# EAGLE design Pedal Box Board rev5 (EAGLE 8.4.1)
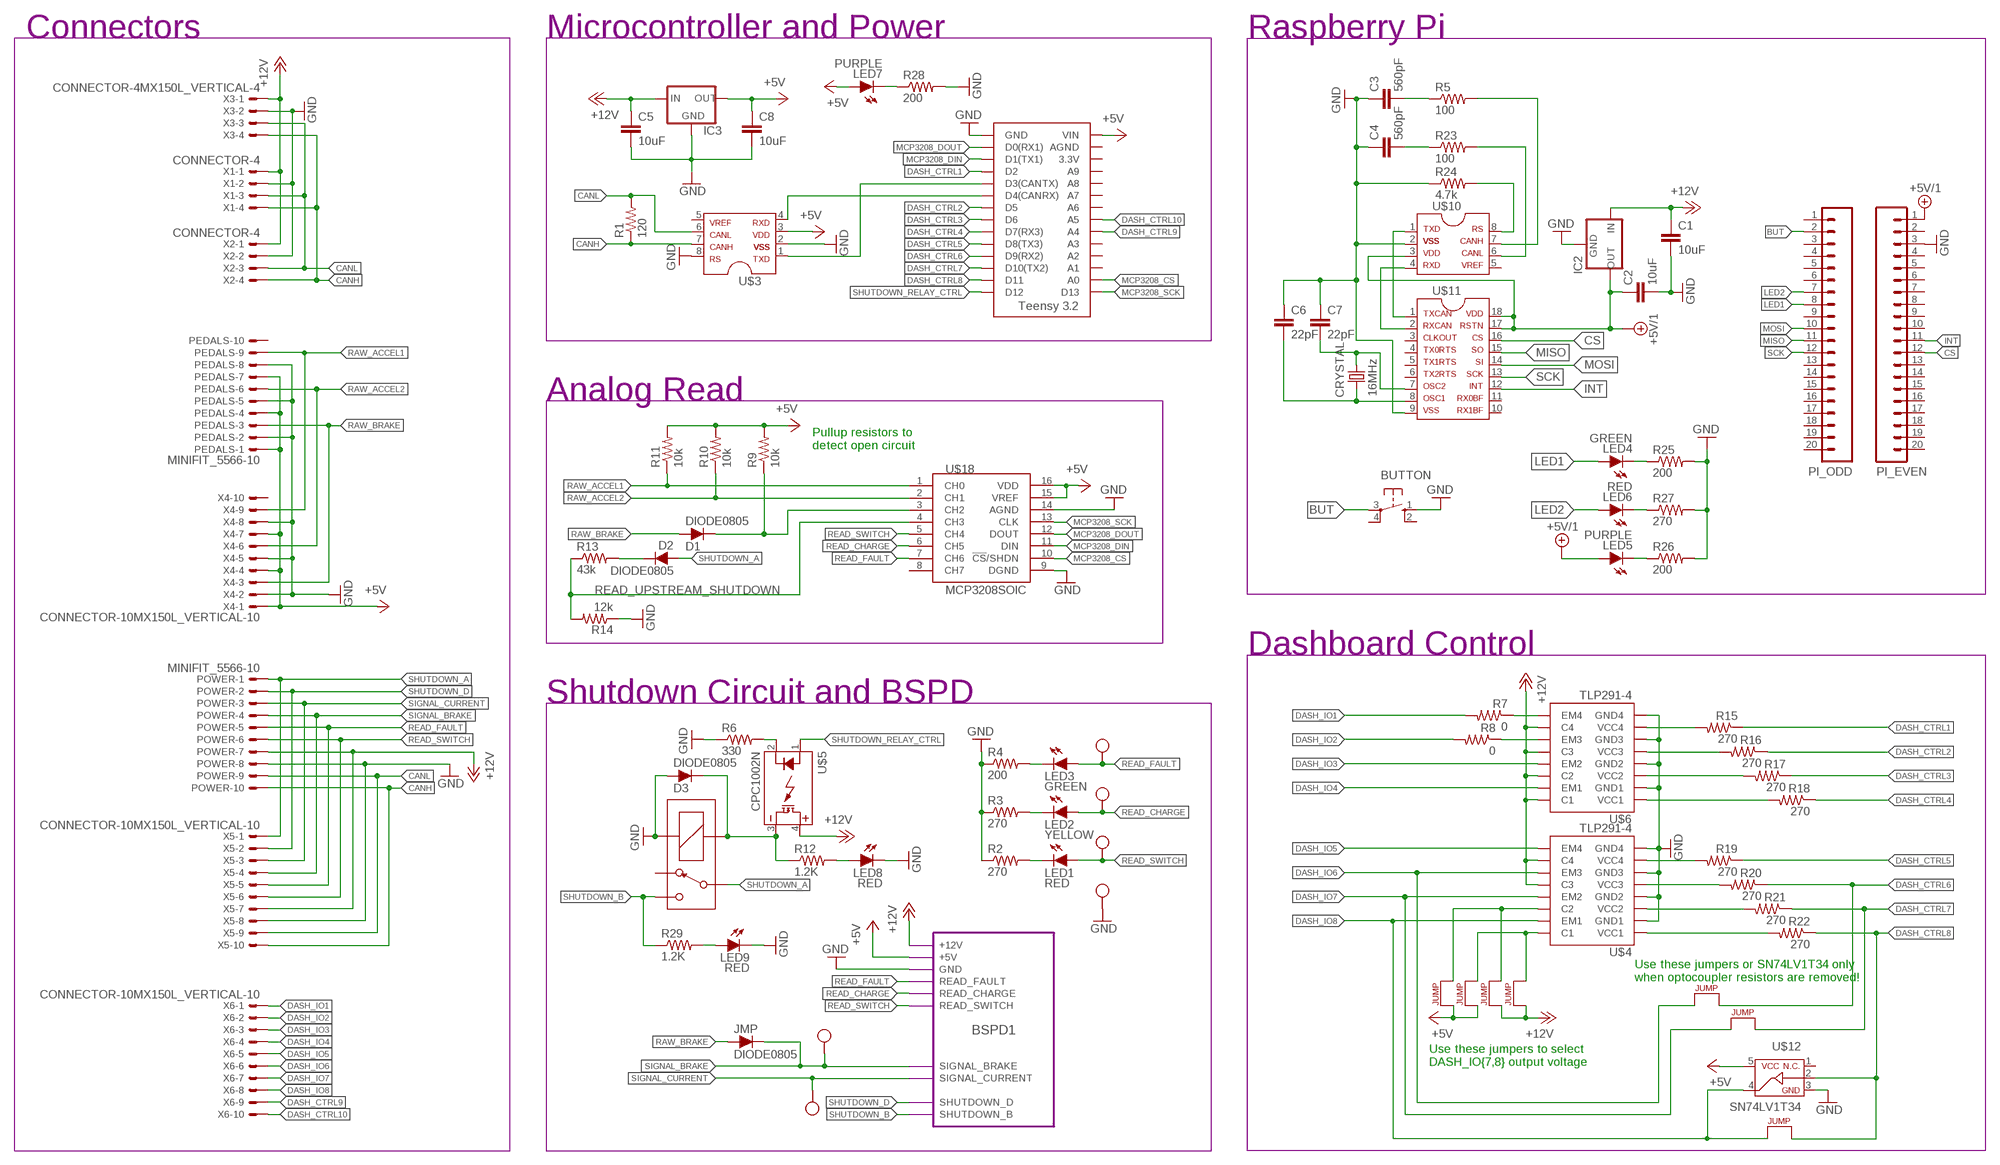
[diagram p0: schematic, sheet 1]

## Parts
BUTTON  BTN_10-XX  [B3F-10XX]
C1  10uF  CAP0805  [0805]
C2  10uF  CAP0805  [0805]
C3  560pF  CAP0805  [0805]
C4  560pF  CAP0805  [0805]
C5  10uF  CAP0805  [0805]
C6  22pF  CAP0805  [0805]
C7  22pF  CAP0805  [0805]
C8  10uF  CAP0805  [0805]
CRYSTAL  16MHz  CRYSTALSMD  [HC49UP]
D1  DIODE0805  [0805_D]
D2  DIODE0805  [0805_D]
D3  DIODE0805  [0805_D]
IC2  OKI-78SR-5/1.5-W36-C_VERT  [TO-220]
IC3  OKI-78SR-5/1.5-W36-C_VERT  [TO-220]
JMP  DIODE0805  [0805_D]
LED1  RED  LED-0805  [LED-805]
LED2  YELLOW  LED-0805  [LED-805]
LED3  GREEN  LED-0805  [LED-805]
LED4  GREEN  LED-0805  [LED-805]
LED5  PURPLE  LED-0805  [LED-805]
LED6  RED  LED-0805  [LED-805]
LED7  PURPLE  LED-0805  [LED-805]
LED8  RED  LED-0805  [LED-805]
LED9  RED  LED-0805  [LED-805]
PEDALS  MINIFIT_5566-10  [MINIFIT_5566-10]
PI_EVEN  M20  [1X20]
PI_ODD  M20  [1X20]
POWER  MINIFIT_5566-10  [MINIFIT_5566-10]
R1  120  RESISTOR0805-RES  [0805]
R2  270  RESISTOR0805-RES  [0805]
R3  270  RESISTOR0805-RES  [0805]
R4  200  RESISTOR0805-RES  [0805]
R5  100  RESISTOR0805-RES  [0805]
R6  330  RESISTOR0805-RES  [0805]
R7  0  RESISTOR0805-RES  [0805]
R8  0  RESISTOR0805-RES  [0805]
R9  10k  RESISTOR0805-RES  [0805]
R10  10k  RESISTOR0805-RES  [0805]
R11  10k  RESISTOR0805-RES  [0805]
R12  1.2K  RESISTOR0805-RES  [0805]
R13  43k  RESISTOR0805-RES  [0805]
R14  12k  RESISTOR0805-RES  [0805]
R15  270  RESISTOR0805-RES  [0805]
R16  270  RESISTOR0805-RES  [0805]
R17  270  RESISTOR0805-RES  [0805]
R18  270  RESISTOR0805-RES  [0805]
R19  270  RESISTOR0805-RES  [0805]
R20  270  RESISTOR0805-RES  [0805]
R21  270  RESISTOR0805-RES  [0805]
R22  270  RESISTOR0805-RES  [0805]
R23  100  RESISTOR0805-RES  [0805]
R24  4.7k  RESISTOR0805-RES  [0805]
R25  200  RESISTOR0805-RES  [0805]
R26  200  RESISTOR0805-RES  [0805]
R27  270  RESISTOR0805-RES  [0805]
R28  200  RESISTOR0805-RES  [0805]
R29  1.2K  RESISTOR0805-RES  [0805]
SOFTWARE_SHUTOFF  G5LE  [ZF112]
U$1  TEENSY_3.2_SIMPLE  [TEENSY_3.2_SIMPLE]
U$2  TEST_POINT  [TEST_POINT]
U$3  MCP2551  [SOIC-08]
U$4  TLP291-4  [SOIC-16]
U$5  CPC1002N  [SOP04]
U$6  TLP291-4  [SOIC-16]
U$7  JUMPER  [0805]
U$8  JUMPER  [0805]
U$9  JUMPER  [0805]
U$10  MCP2551  [SOIC-08]
U$11  MCP2515SMD  [SOIC-18W]
U$12  SN74LV1T34  [SOT-23-5]
U$13  TEST_POINT  [TEST_POINT]
U$14  TEST_POINT  [TEST_POINT]
U$15  TEST_POINT  [TEST_POINT]
U$16  TEST_POINT  [TEST_POINT]
U$17  TEST_POINT  [TEST_POINT]
U$18  MCP3208SOIC  [SOIC-16]
U$19  JUMPER  [0805]
U$20  JUMPER  [0805]
U$21  JUMPER  [0805]
U$22  JUMPER  [0805]
X1  CONNECTOR-4  [MINIFIT_5566-4]
X2  CONNECTOR-4  [MINIFIT_5566-4]
X3  CONNECTOR-4MX150L_VERTICAL-4  [MX150L_VERTICAL-4]
X4  CONNECTOR-10MX150L_VERTICAL-10  [MX150L_VERTICAL-10]
X5  CONNECTOR-10MX150L_VERTICAL-10  [MX150L_VERTICAL-10]
X6  CONNECTOR-10MX150L_VERTICAL-10  [MX150L_VERTICAL-10]

## Module instances
BSPD1 = BSPD

## Nets
+5V: C8.1 IC3.3(OUT) LED7.A PEDALS.1 PEDALS.4 PEDALS.7 R9.2 R10.2 R11.2 U$1.VIN U$3.3 U$12.5 U$18.15(VREF) U$18.16(VDD) U$20.1 U$22.1 X4.1 X4.4 X4.7 ; port BSPD1.+5V
+5V/1: C2.1 IC2.3(OUT) LED5.A PI_EVEN.1 U$10.3 U$11.17 U$11.18
+12V: C1.1 C5.1 IC2.1(IN) IC3.1(IN) POWER.7 U$4.10(C4) U$4.12(C3) U$5.4(DC+) U$6.10(C4) U$6.12(C3) U$6.14(C2) U$6.16(C1) U$9.1 U$21.1 X1.1 X2.1 X3.1 X5.7 ; port BSPD1.+12V
BUT: BUTTON.3(P) PI_ODD.2
CAN-H: R5.2 U$10.7
CAN-L: R23.2 U$10.6
CANH: POWER.10 R1.1 U$3.7 X1.4 X2.4 X3.4 X5.10
CANL: POWER.9 R1.2 U$3.6 X1.3 X2.3 X3.3 X5.9
CS: PI_EVEN.12 U$11.16
DASH_CTRL1: R15.1 U$1.D2
DASH_CTRL2: R16.1 U$1.D5
DASH_CTRL3: R17.1 U$1.D6
DASH_CTRL4: R18.1 U$1.D7(RX3)
DASH_CTRL5: R19.1 U$1.D8(TX3)
DASH_CTRL6: R20.1 U$1.D9(RX2) U$7.2
DASH_CTRL7: R21.1 U$1.D10(TX2) U$8.2
DASH_CTRL8: R22.1 U$1.D11 U$12.2 U$19.2
DASH_CTRL9: U$1.A4 X6.9
DASH_CTRL10: U$1.A5 X6.10
DASH_IO1: R7.2 X6.1
DASH_IO2: R8.2 X6.2
DASH_IO3: U$6.13(EM2) X6.3
DASH_IO4: U$6.15(EM1) X6.4
DASH_IO5: U$4.9(EM4) X6.5
DASH_IO6: U$4.11(EM3) U$7.1 X6.6
DASH_IO7: U$4.13(EM2) U$8.1 X6.7
DASH_IO8: U$4.15(EM1) U$12.4 U$19.1 X6.8
GND: BUTTON.1(S) C1.2 C2.2 C3.1 C4.1 C5.2 C6.1 C7.1 C8.2 D3.A IC2.2(GND) IC3.2(GND) LED8.C LED9.C PEDALS.2 PEDALS.5 PEDALS.8 PI_EVEN.3 POWER.8 R2.1 R3.1 R4.1 R6.1 R14.1 R24.1 R25.2 R26.2 R27.2 R28.2 SOFTWARE_SHUTOFF.1(COIL+) U$1.GND U$2.P$1 U$3.2 U$3.8 U$4.2(GND1) U$4.4(GND2) U$4.6(GND3) U$4.8(GND4) U$6.2(GND1) U$6.4(GND2) U$6.6(GND3) U$6.8(GND4) U$10.2 U$11.9 U$12.3 U$18.9(DGND) U$18.14(AGND) X1.2 X2.2 X3.2 X4.2 X4.5 X4.8 X5.8 ; port BSPD1.GND
INT: PI_EVEN.11 U$11.12
LED1: LED4.A PI_ODD.8
LED2: LED6.A PI_ODD.7
MCP3208_CS: U$1.A0 U$18.10(!CS!/SHDN)
MCP3208_DIN: U$1.D1(TX1) U$18.11(DIN)
MCP3208_DOUT: U$1.D0(RX1) U$18.12(DOUT)
MCP3208_SCK: U$1.D13 U$18.13(CLK)
MISO: PI_ODD.11 U$11.15
MOSI: PI_ODD.10 U$11.14
N$1: R7.1 U$6.9(EM4)
N$2: U$1.D4(CANRX) U$3.4
N$3: R8.1 U$6.11(EM3)
N$4: U$4.16(C1) U$9.2 U$20.2
N$5: U$1.D3(CANTX) U$3.1
N$6: U$4.14(C2) U$21.2 U$22.2
N$7: D1.C R9.1 U$18.3(CH2)
N$8: LED8.A R12.2
N$9: LED9.A R29.2
N$12: D3.C R12.1 SOFTWARE_SHUTOFF.2(COIL-) U$5.3(DC-)
N$13: D2.C R13.2
N$14: LED1.C R2.2
N$15: LED2.C R3.2
N$16: LED3.C R4.2
N$19: R15.2 U$6.7(VCC4)
N$22: R6.2 U$5.2(CONTROL-)
N$24: R16.2 U$6.5(VCC3)
N$27: R21.2 U$4.3(VCC2)
N$28: R17.2 U$6.3(VCC2)
N$29: R18.2 U$6.1(VCC1)
N$31: R19.2 U$4.7(VCC4)
N$32: R20.2 U$4.5(VCC3)
N$35: R22.2 U$4.1(VCC1)
N$37: U$10.1 U$11.1
N$39: U$10.4 U$11.2
N$40: C6.2 CRYSTAL.2 U$11.8
N$41: R24.2 U$10.8
N$42: C7.2 CRYSTAL.1 U$11.7
N$43: C3.2 R5.1
N$50: C4.2 R23.1
N$52: LED4.C R25.1
N$53: LED5.C R26.1
N$54: LED6.C R27.1
N$61: LED7.C R28.1
RAW_ACCEL1: PEDALS.9 R11.1 U$18.1(CH0) X4.9
RAW_ACCEL2: PEDALS.6 R10.1 U$18.2(CH1) X4.6
RAW_BRAKE: D1.A JMP.A PEDALS.3 X4.3
READ_CHARGE: LED2.A U$16.P$1 U$18.6(CH5) ; port BSPD1.READ_CHARGE
READ_FAULT: LED3.A POWER.5 U$15.P$1 U$18.7(CH6) X5.5 ; port BSPD1.READ_FAULT
READ_SWITCH: LED1.A POWER.6 U$17.P$1 U$18.5(CH4) X5.6 ; port BSPD1.READ_SWITCH
READ_UPSTREAM_SHUTDOWN: R13.1 R14.2 U$18.4(CH3)
SCK: PI_ODD.12 U$11.13
SHUTDOWN_A: D2.A POWER.1 SOFTWARE_SHUTOFF.P X5.1
SHUTDOWN_B: R29.1 SOFTWARE_SHUTOFF.S ; port BSPD1.SHUTDOWN_B
SHUTDOWN_D: POWER.2 X5.2 ; port BSPD1.SHUTDOWN_D
SHUTDOWN_RELAY_CTRL: U$1.D12 U$5.1(CONTROL+)
SIGNAL_BRAKE: JMP.C POWER.4 U$13.P$1 X5.4 ; port BSPD1.SIGNAL_BRAKE
SIGNAL_CURRENT: POWER.3 U$14.P$1 X5.3 ; port BSPD1.SIGNAL_CURRENT
Unconnected: BUTTON.2(S1) BUTTON.4(P1) PEDALS.10 PI_EVEN.2 PI_EVEN.4 PI_EVEN.5 PI_EVEN.6 PI_EVEN.7 PI_EVEN.8 PI_EVEN.9 PI_EVEN.10 PI_EVEN.13 PI_EVEN.14 PI_EVEN.15 PI_EVEN.16 PI_EVEN.17 PI_EVEN.18 PI_EVEN.19 PI_EVEN.20 PI_ODD.1 PI_ODD.3 PI_ODD.4 PI_ODD.5 PI_ODD.6 PI_ODD.9 PI_ODD.13 PI_ODD.14 PI_ODD.15 PI_ODD.16 PI_ODD.17 PI_ODD.18 PI_ODD.19 PI_ODD.20 SOFTWARE_SHUTOFF.O U$1.3.3V U$1.A1 U$1.A2 U$1.A3 U$1.A6 U$1.A7 U$1.A8 U$1.A9 U$1.AGND U$3.5 U$10.5 U$11.3 U$11.4 U$11.5 U$11.6 U$11.10 U$11.11 U$12.1 U$18.8(CH7) X4.10

## Notes on the sheet
- Connectors | Microcontroller and Power | Raspberry Pi
- Analog Read
- Pullup resistors to
  detect open circuit
- Dashboard Control
- Shutdown Circuit and BSPD
- Use these jumpers or SN74LV1T34 only
  when optocoupler resistors are removed!
- Use these jumpers to select
  DASH_IO{7,8} output voltage

## Library data of the parts
BUTTON = HyTechDevices:BTN_10-XX: Small momentary tactile push button; MPN: B3F-1000; OC_FARNELL: 176432; OC_NEWARK: 36M3542
C1-C8 = HyTechDevices:CAP: Capacitor Standard 0603 ceramic capacitor, and 0.1" leaded capacitor.
CRYSTAL = SparkFun-FreqCtrl:CRYSTAL: Various standard crystals. Proven footprints.
D1-D3 JMP = HyTechDevices:DIODE: DIODE general purpose rectifier
IC2 IC3 = HyTechDevices:OKI-78SR-5/1.5-W36-C: Voltage Regulator Switching 5v regulator Datasheet <http://power.murata.com/data/power/oki-78sr.pdf> Standard 7805 5V regulator. IGO (Input Ground Output). Spark Fun Electronics SKU : COM-00107 Datasheet <http://www.mouser.com/ds/2/308/MC7800-D-94905.pdf>
LED1-LED9 = HyTechDevices:LED: Light Emitting Diode (LED) Source: Dangerous Prototypes Eagle Library <https://github.com/DangerousPrototypes/Eagle_Part_Library>
PEDALS POWER = HyTechDevices:MINIFIT_5566-10: Mini-Fit Junior connector 10 pole Source: http://www.molex.com; OC_FARNELL: unknown; OC_NEWARK: unknown
PI_EVEN PI_ODD = HyTechDevices:M20: 1x20 .1" header This is just like the LOCK variant in that the holes are staggared by 5 mil, but except for the last two holes. They are not altered from the "standard" footprint layout. This is used for a special purpose on the layout of our Graphic LCD Backpack. Make sure you want to use this device before selecting it for you project! Source: Sparkfun <https://github.com/sparkfun/SparkFun-Eagle-Libraries>
R1-R29 = HyTechDevices:RESISTOR: Resistor Basic schematic elements and footprints for 0603, 1206, and PTH resistors.
SOFTWARE_SHUTOFF = HyTechDevices:G5LE: Omron G5LE SPST Relay 5 VDC, 12VDC, 24VDC models Coil voltage: 75% - 170% of nominal voltage Datasheet <https://www.omron.com/ecb/products/pdf/en-g5le.pdf>
U$1 = HyTechDevices:TEENSY_3.2_SIMPLE: Simple version of the Teensy 3.2 board that only uses the 2 main rows of pins, not the inner pins or the pins opposite the usb port.
U$2 U$13-U$17 = HyTechDevices:TEST_POINT: Keystone Electronics Test Point 5005
U$3 U$10 = HyTechDevices:MCP2551: MCP2551 High-Speed CAN Transceiver Product Webpage <https://www.microchip.com/wwwproducts/en/MCP2551> Datasheet <http://ww1.microchip.com/downloads/en/DeviceDoc/21667f.pdf> This device is outdated It is replaced by MCP2561. Comparison Page <https://www.microchip.com/wwwproducts/ProductCompare/MCP2551/MCP2561> Product Webpage <https://www.microchip.com/wwwproducts/en/MCP2561> Datasheet <http://ww1.microchip.com/downloads/en/DeviceDoc/20005167C.pdf>
U$4 U$6 = HyTechDevices:TLP291-4: Toshiba Quad Channel Optocoupler TLP291-4
U$5 = HyTechDevices:CPC1002N: IXYS Solid State Relay .7A
U$7-U$9 U$19-U$22 = HyTechDevices:JUMPER: Jumper for changing operation of a device
U$11 = HyTechDevices:MCP2515: MCP2515 CAN Controller with SPI Interface Datasheet <http://ww1.microchip.com/downloads/en/DeviceDoc/21801G.pdf>
U$12 = HyTechDevices:SN74LV1T34: TI SN74LV1T34 Single Power Supply Single Buffer GATE CMOS Logic Level Shifter Datasheet <http://www.ti.com/lit/ds/symlink/sn74lv1t34.pdf>
U$18 = HyTechDevices:MCP3208: Analog to Digital Converter
X1 X2 = HyTechDevices:CONNECTOR-4: Mini-Fit Junior connector 4 pole Source: http://www.molex.com; OC_FARNELL: unknown; OC_NEWARK: unknown
X3 = HyTechDevices:CONNECTOR-4: Mini-Fit Junior connector 4 pole Source: http://www.molex.com
X4-X6 = HyTechDevices:CONNECTOR-10: Mini-Fit Junior connector 10 pole Source: http://www.molex.com

## Module BSPD
Ports: GND(out) +5V(in) READ_CHARGE(out) SHUTDOWN_B(in) READ_SWITCH(out) READ_FAULT(out) SHUTDOWN_D(out) SIGNAL_BRAKE(in) SIGNAL_CURRENT(in) +12V(in)
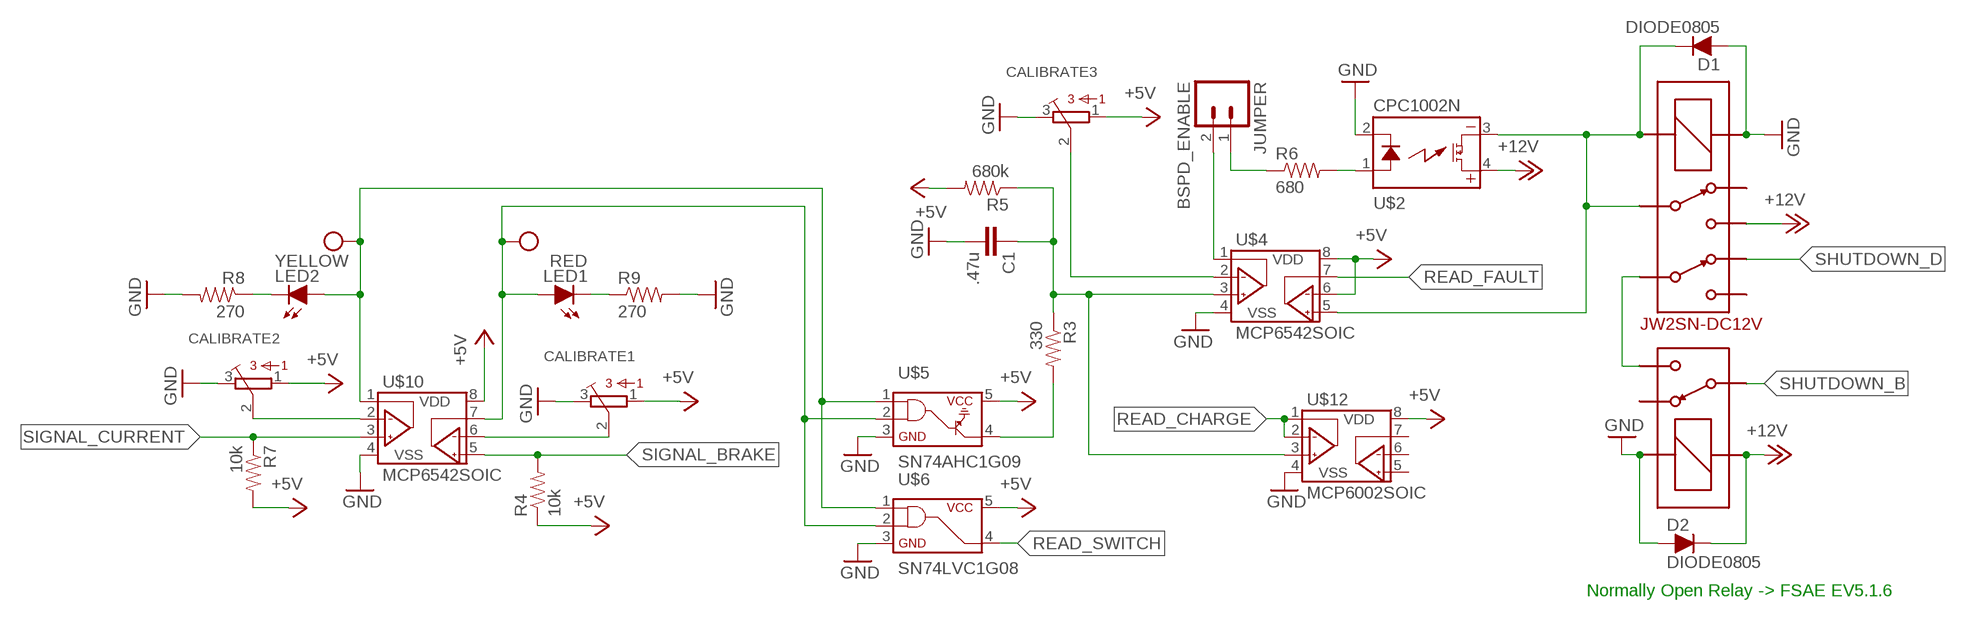
[diagram p1: schematic, module BSPD, sheet 1]

### Parts
BSPD_ENABLE  JUMPER  M02  [1X02]
C1  .47u  CAPEZ  [CAP-PTH-SMALLEZ]
CALIBRATE1  TRIMPOT_3296C  [TRIMPOT_3296]
CALIBRATE2  TRIMPOT_3296C  [TRIMPOT_3296]
CALIBRATE3  TRIMPOT_3296C  [TRIMPOT_3296]
D1  DIODE0805  [0805_D]
D2  DIODE0805  [0805_D]
LED1  RED  LED-0805  [LED-805]
LED2  YELLOW  LED-0805  [LED-805]
R3  330  RESISTOR0805-RES  [0805]
R4  10k  RESISTOR0805-RES  [0805]
R5  680k  RESISTOREZ  [AXIAL-0.3EZ]
R6  680  RESISTOR0805-RES  [0805]
R7  10k  RESISTOR0805-RES  [0805]
R8  270  RESISTOR0805-RES  [0805]
R9  270  RESISTOR0805-RES  [0805]
U$1  G5LE  [ZF112]
U$2  CPC1002N  [SOP04]
U$3  JW2SN-DC12V  [JW2SN]
U$4  MCP6542SOIC  [SOIC-08]
U$5  SN74AHC1G09  [SOT-23-5]
U$6  SN74LVC1G08  [SOT-23-5]
U$10  MCP6542SOIC  [SOIC-08]
U$11  TEST_POINT  [TEST_POINT]
U$12  MCP6002SOIC  [SOIC-08]
U$13  TEST_POINT  [TEST_POINT]

### Nets
+5V: CALIBRATE1.1 CALIBRATE2.1 CALIBRATE3.1 R4.1 R5.P$2 R7.2 U$4.6(VINB-) U$4.8(VDD) U$5.5 U$6.5 U$10.8(VDD) U$12.8(VDD)
+12V: D2.C U$1.2(COIL-) U$2.4(DC+) U$3.4
GND: C1.2 CALIBRATE1.3 CALIBRATE2.3 CALIBRATE3.3 D1.A D2.A R8.2 R9.2 U$1.1(COIL+) U$2.2(CONTROL-) U$3.COIL+ U$4.4(VSS) U$5.3 U$6.3 U$10.4(VSS) U$12.4(VSS)
N$1: D1.C U$2.3(DC-) U$3.3 U$3.COIL- U$4.5(VINB+)
N$2: R3.2 U$5.4
N$3: R6.2 U$2.1(CONTROL+)
N$4: BSPD_ENABLE.1 R6.1
N$5: CALIBRATE2.2 U$10.2(VINA-)
N$6: CALIBRATE1.2 U$10.6(VINB-)
N$7: CALIBRATE3.2 U$4.2(VINA-)
N$8: BSPD_ENABLE.2 U$4.1(VOUTA)
N$13: C1.1 R3.1 R5.P$1 U$4.3(VINA+) U$12.3(VINA+)
N$14: LED2.C R8.1
N$15: LED1.C R9.1
N$16: LED1.A U$5.2 U$6.2 U$10.7(VOUTB) U$11.P$1
N$17: LED2.A U$5.1 U$6.1 U$10.1(VOUTA) U$13.P$1
READ_CHARGE: U$12.1(VOUTA) U$12.2(VINA-)
READ_FAULT: U$4.7(VOUTB)
READ_SWITCH: U$6.4
SHUTDOWN_B: U$1.P
SHUTDOWN_C: U$1.S U$3.6
SHUTDOWN_D: U$3.7
SIGNAL_BRAKE: R4.2 U$10.5(VINB+)
SIGNAL_CURRENT: R7.1 U$10.3(VINA+)
Unconnected: U$1.O U$3.2 U$3.5 U$12.5(VINB+) U$12.6(VINB-) U$12.7(VOUTB)

### Notes on the sheet
- Normally Open Relay -> FSAE EV5.1.6

### Library data of the parts
BSPD_ENABLE = HyTechDevices:M02: Standard 2-pin 0.1" header. NOTES ON THE VARIANTS LOCK and LOCK_LONGPADS... This footprint was designed to help hold the alignment of a through-hole component (i.e. 6-pin header) while soldering it into place. You may notice that each hole has been shifted either up or down by 0.005 of an inch from it's more standard position (which is a perfectly straight line). This slight alteration caused the pins (the squares in the middle) to touch the edges of the holes. Because they are alternating, it causes a "brace" to hold the component in place. 0.005 has proven to be the perfect amount of "off-center" position when using our standard breakaway headers. Although looks a little odd when you look at the bare footprint, once you have a header in there, the alteration is very hard to notice. Also,if you push a header all the way into place, it is covered up entirely on the bottom side. This idea of altering the position of holes to aid alignment will be further integrated into the Sparkfun Library for other footprints. It can help hold any component with 3 or more connection pins. Note: The Sparkfun version includes many other packages including surface mount that may be of future interest. Source: Sparkfun <https://github.com/sparkfun/SparkFun-Eagle-Libraries>
C1 = HyTechDevices:CAP: Capacitor Standard 0603 ceramic capacitor, and 0.1" leaded capacitor.
CALIBRATE1-CALIBRATE3 = HyTechDevices:TRIMPOT_3296: 3296 Series 3/8" Square Trimmer Source <https://github.com/chiengineer/Eagle-Libraries/blob/master/Potentiometers/bourns.lbr>
D1 D2 = HyTechDevices:DIODE: DIODE general purpose rectifier
LED1 LED2 = HyTechDevices:LED: Light Emitting Diode (LED) Source: Dangerous Prototypes Eagle Library <https://github.com/DangerousPrototypes/Eagle_Part_Library>
R3-R9 = HyTechDevices:RESISTOR: Resistor Basic schematic elements and footprints for 0603, 1206, and PTH resistors.
U$1 = HyTechDevices:G5LE: Omron G5LE SPST Relay 5 VDC, 12VDC, 24VDC models Coil voltage: 75% - 170% of nominal voltage Datasheet <https://www.omron.com/ecb/products/pdf/en-g5le.pdf>
U$2 = HyTechDevices:CPC1002N: IXYS Solid State Relay .7A
U$3 = HyTechDevices:JW2SN-DC12V: Panasonic Double Pull Double Throw Relay 12VDC Datasheet <http://www.mouser.com/ds/2/316/jw-catalog-461998.pdf> Product Page <http://www.mouser.com/ProductDetail/Panasonic-Industrial-Devices/JW2SN-DC12V>
U$4 U$10 = HyTechDevices:MCP6542: Microchip MCP6542 Dual Channel Push-Pull Comparator
U$5 = HyTechDevices:SN74AHC1G09: TI SN74AHC1G09 Single 2–Input Positive-AND Gate With Open-Drain Output Datasheet <http://www.ti.com/lit/ds/symlink/sn74ahc1g09.pdf>
U$6 = HyTechDevices:SN74LVC1G08: TI SN74LVC1G08 SINGLE 2-INPUT POSITIVE-AND GATE Datasheet <http://www.ti.com/lit/ds/sces556f/sces556f.pdf>
U$11 U$13 = HyTechDevices:TEST_POINT: Keystone Electronics Test Point 5005
U$12 = HyTechDevices:MCP6002: Microchip MCP6002 Dual Channel Op Amp

## Board
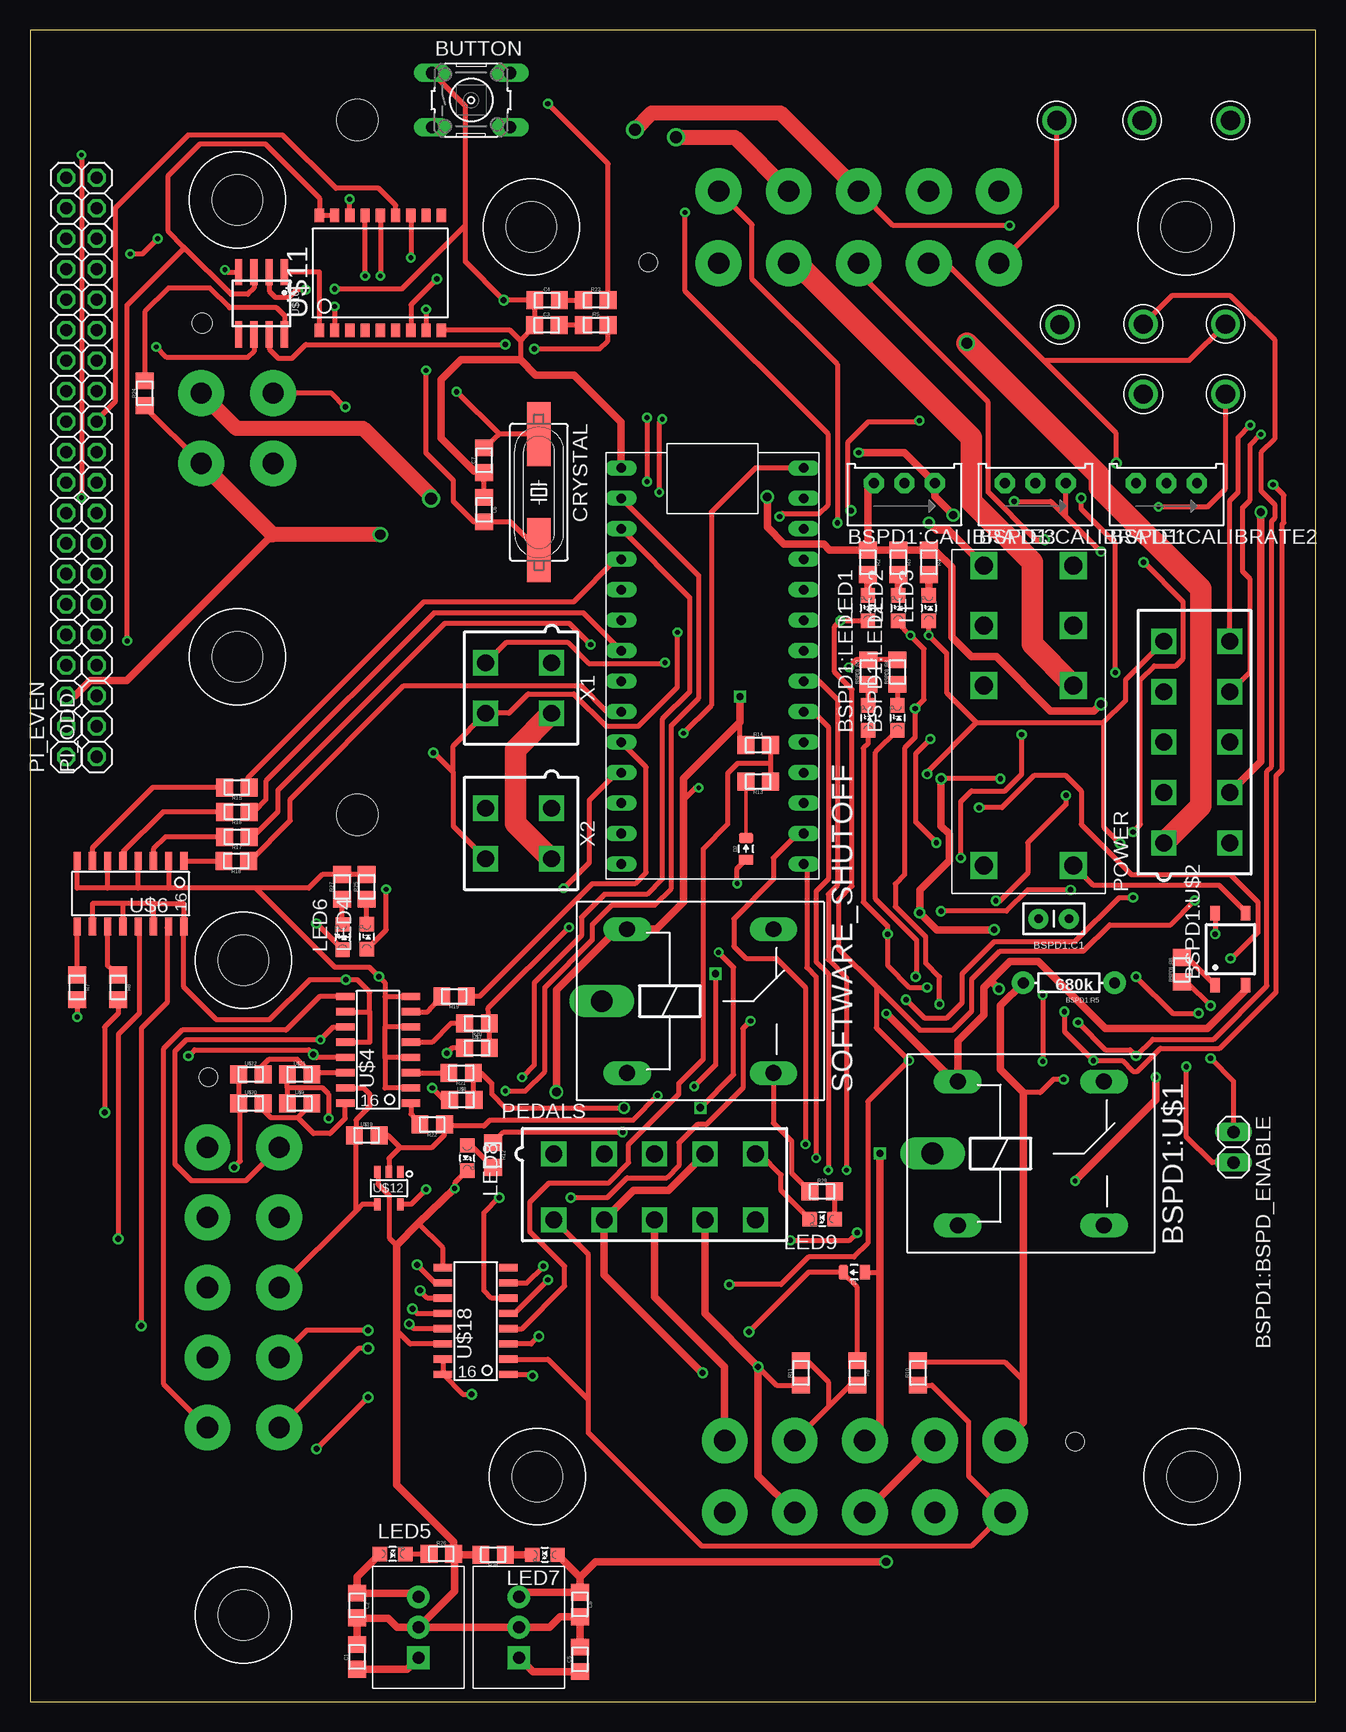
[diagram p2: board, top side]
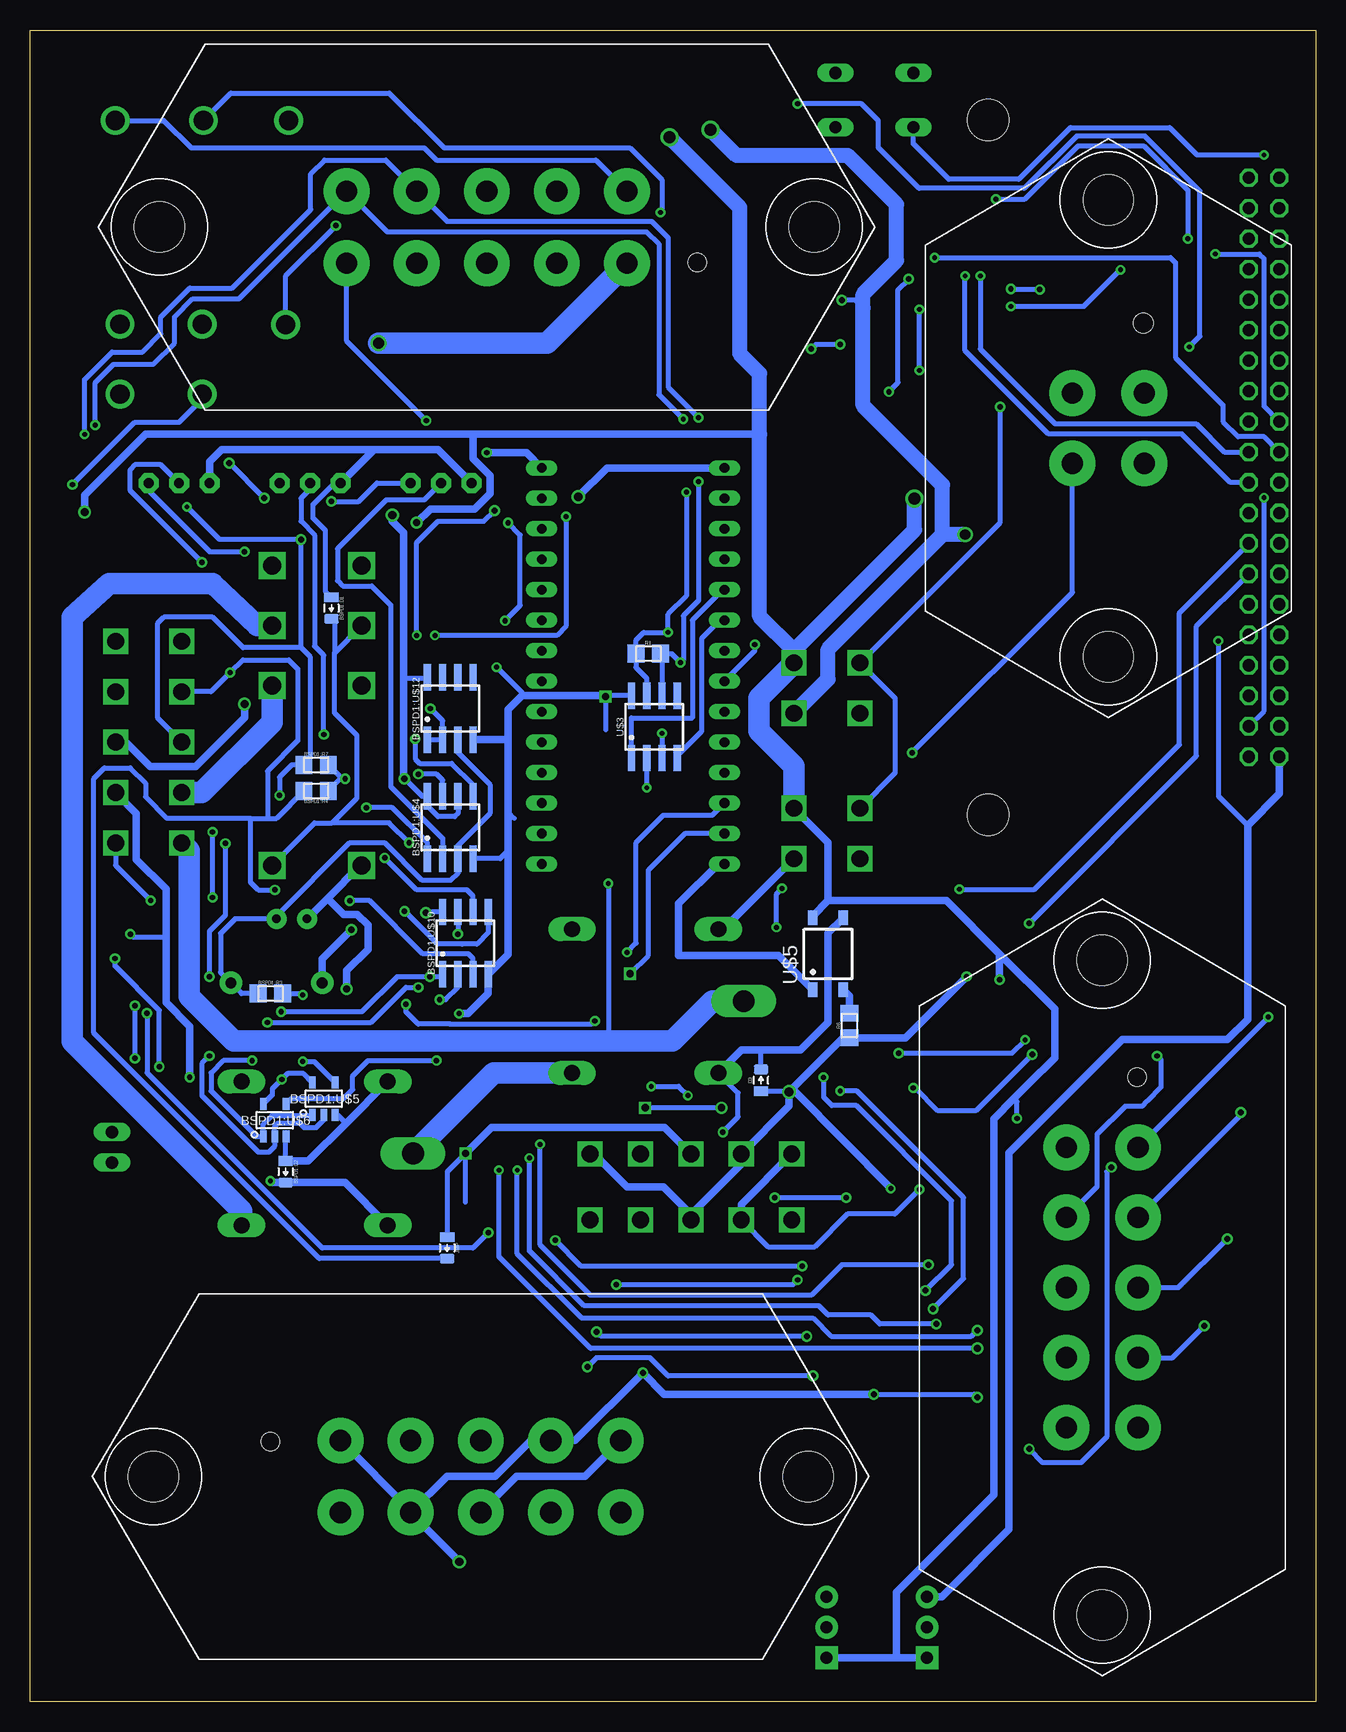
[diagram p3: board, bottom side, seen from below]

Size 107.17 x 139.37 mm. Coordinates in mm from the lower left corner, seen from the top.
Outline: 0,0 107.17,0 107.17,139.37 0,139.37 0,0
Copper layers (1*16): Top 0.035mm / dielectric 1.5mm / Bottom 0.035mm
Design rules "default *": minimum track width 6mil, minimum drill 15mil, track to track 8mil, track to pad 8mil, pad to pad 8mil, via to via 8mil, smd to smd 8mil, copper to edge 40mil, drill to drill 8mil, minimum pad ring 10mil, minimum via ring 8mil, stop-mask expansion 4mil, vias tented up to drill 0mil, thermal gap 10mil
Holes 3.43 mm at 27.28,131.88 27.28,73.96
tKeepout: area 23,69.7 to 31.4,78.1; area 23.1,127.6 to 31.5,136

### Footprints (pad centres in the part's own frame; a part is rotated, then mirrored left to right if it is on the bottom)
1X02 = drill 1.016 long: 1 -1.27,0; 2 1.27,0
CAP-PTH-SMALLEZ = drill 0.7 pad 1.651: 1 0,0; 2 2.54,0
TRIMPOT_3296 = drill 0.813 pad 1.676 octagon: 1 2.54,1.27; 2 0,1.27; 3 -2.54,1.27
0805_D = smd 0.8 x 1.2: A -0.9,0; C 0.9,0
LED-805 = smd 1.2 x 1.2: A 0,-1.05; C 0,1.05
0805 = smd 1.4 x 1.5: 1 -1.025,0; 2 1.025,0
AXIAL-0.3EZ = drill 0.9 pad 1.88: P$1 -3.81,0; P$2 3.81,0
ZF112 = drill 1.321 long: 1 4.064,14.884; 2 4.064,2.896; O 16.256,14.884; S 16.256,2.896 | drill 1.803 long: P 1.956,8.89
SOP04 = smd 0.8 x 1.2: 1 -1.27,-3; 2 1.27,-3; 3 1.27,3; 4 -1.27,3
JW2SN = drill 1.5 square: 2 10.008,0; 3 5.004,0; 4 0,0; 5 0,7.493; 6 5.004,7.493; 7 10.008,7.493; COIL+ 25.019,0; COIL- 25.019,7.493
SOIC-08 = smd 0.6 x 2.2: 1 -1.905,-2.6; 2 -0.635,-2.6; 3 0.635,-2.6; 4 1.905,-2.6; 5 1.905,2.6; 6 0.635,2.6; 7 -0.635,2.6; 8 -1.905,2.6
SOT-23-5 = smd 1 x 0.55: 1 -1.35,0.95; 2 -1.35,0; 3 -1.35,-0.95; 4 1.35,-0.95; 5 1.35,0.95
TEST_POINT = drill 1.6: P$1 0,0
B3F-10XX = drill 1.016 long: 1 -3.251,2.261; 2 3.251,2.261; 3 -3.251,-2.261; 4 3.251,-2.261
HC49UP = smd 5.334 x 1.93: 1 -4.826,0; 2 4.826,0
TO-220 = drill 1 pad 1.88 square: 1 -2.54,0 | drill 1 pad 1.88: 2 0,0; 3 2.54,0
MINIFIT_5566-10 = drill 1.4 square: 1 8.4,-2.75; 2 4.2,-2.75; 3 0,-2.75; 4 -4.2,-2.75; 5 -8.4,-2.75; 6 8.4,2.75; 7 4.2,2.75; 8 0,2.75; 9 -4.2,2.75; 10 -8.4,2.75
1X20 = drill 1.016 octagon: 1 0,0; 2 2.54,0; 3 5.08,0; 4 7.62,0; 5 10.16,0; 6 12.7,0; 7 15.24,0; 8 17.78,0; 9 20.32,0; 10 22.86,0; 11 25.4,0; 12 27.94,0; 13 30.48,0; 14 33.02,0; 15 35.56,0; 16 38.1,0; 17 40.64,0; 18 43.18,0; 19 45.72,0; 20 48.26,0
TEENSY_3.2_SIMPLE = drill 0.8 long: 3.3V 16.51,29.21; A0 16.51,3.81; A1 16.51,6.35; A2 16.51,8.89; A3 16.51,11.43; A4 16.51,13.97; A5 16.51,16.51; A6 16.51,19.05; A7 16.51,21.59; A8 16.51,24.13; A9 16.51,26.67; AGND 16.51,31.75; D0(RX1) 1.27,31.75; D1(TX1) 1.27,29.21; D2 1.27,26.67; D3(CANTX) 1.27,24.13; D4(CANRX) 1.27,21.59; D5 1.27,19.05; D6 1.27,16.51; D7(RX3) 1.27,13.97; D8(TX3) 1.27,11.43; D9(RX2) 1.27,8.89; D10(TX2) 1.27,6.35; D11 1.27,3.81; D12 1.27,1.27; D13 16.51,1.27; GND 1.27,34.29; VIN 16.51,34.29
SOIC-16 = smd 0.61 x 1.524: 1 -4.445,-2.794; 2 -3.175,-2.794; 3 -1.905,-2.794; 4 -0.635,-2.794; 5 0.635,-2.794; 6 1.905,-2.794; 7 3.175,-2.794; 8 4.445,-2.794; 9 4.445,2.667; 10 3.175,2.667; 11 1.905,2.667; 12 0.635,2.667; 13 -0.635,2.667; 14 -1.905,2.667; 15 -3.175,2.667; 16 -4.445,2.667
SOIC-18W = smd 0.762 x 1.143: 1 -5.08,-4.788; 2 -3.81,-4.788; 3 -2.54,-4.788; 4 -1.27,-4.788; 5 0,-4.788; 6 1.27,-4.788; 7 2.54,-4.788; 8 3.81,-4.788; 9 5.08,-4.788; 10 5.08,4.788; 11 3.81,4.788; 12 2.54,4.788; 13 1.27,4.788; 14 0,4.788; 15 -1.27,4.788; 16 -2.54,4.788; 17 -3.81,4.788; 18 -5.08,4.788
MINIFIT_5566-4 = drill 1.4 square: 1 2.1,-2.75; 2 -2.1,-2.75; 3 2.1,2.75; 4 -2.1,2.75
MX150L_VERTICAL-4 = drill 1.778 pad 3.81: 1 -2.921,2.997; 2 2.921,2.997; 3 -2.921,-2.997; 4 2.921,-2.997 | hole 4.191: -19.05,0; 19.05,0 | hole 1.651: -8.763,2.921
MX150L_VERTICAL-10 = drill 1.778 pad 3.81: 1 -11.684,2.997; 2 -5.842,2.997; 3 0,2.997; 4 5.842,2.997; 5 11.684,2.997; 6 -11.684,-2.997; 7 -5.842,-2.997; 8 0,-2.997; 9 5.842,-2.997; 10 11.684,-2.997 | hole 4.191: -27.292,0; 27.292,0 | hole 1.524: -17.526,2.921

### Placement (x,y rotation side)
BSPD1:BSPD_ENABLE  JUMPER  [1X02]  100.33,46.23 270 top
BSPD1:C1  .47u  [CAP-PTH-SMALLEZ]  86.61,65.28 180 top
BSPD1:CALIBRATE1  [TRIMPOT_3296]  83.82,100.33 0 top
BSPD1:CALIBRATE2  [TRIMPOT_3296]  94.74,100.33 0 top
BSPD1:CALIBRATE3  [TRIMPOT_3296]  72.9,100.33 0 top
BSPD1:D1  DIODE0805  [0805_D]  82.04,91.19 270 bottom
BSPD1:D2  DIODE0805  [0805_D]  85.85,44.2 270 bottom
BSPD1:LED1  RED  [LED-805]  69.88,82.04 0 top
BSPD1:LED2  YELLOW  [LED-805]  72.31,82.04 0 top
BSPD1:R3  330  [0805]  87.12,59.05 0 bottom
BSPD1:R4  10k  [0805]  83.31,75.95 180 bottom
BSPD1:R5  680k  [AXIAL-0.3EZ]  86.61,59.94 180 top
BSPD1:R6  680  [0805]  96.01,61.04 90 top
BSPD1:R7  10k  [0805]  83.31,78.11 0 bottom
BSPD1:R8  270  [0805]  72.31,85.85 90 top
BSPD1:R9  270  [0805]  69.88,85.85 90 top
BSPD1:U$1  G5LE  [ZF112]  73.28,36.83 0 top
BSPD1:U$2  CPC1002N  [SOP04]  100.08,62.74 0 top
BSPD1:U$3  JW2SN-DC12V  [JW2SN]  79.5,94.74 270 top
BSPD1:U$4  MCP6542SOIC  [SOIC-08]  72.14,72.9 0 bottom
BSPD1:U$5  SN74AHC1G09  [SOT-23-5]  82.68,50.29 90 bottom
BSPD1:U$6  SN74LVC1G08  [SOT-23-5]  86.77,48.49 90 bottom
BSPD1:U$10  MCP6542SOIC  [SOIC-08]  70.87,63.25 0 bottom
BSPD1:U$11  TEST_POINT  [TEST_POINT]  92.81,114.86 0 top
BSPD1:U$12  MCP6002SOIC  [SOIC-08]  72.14,82.8 0 bottom
BSPD1:U$13  TEST_POINT  [TEST_POINT]  92.81,109.02 0 top
BUTTON  36.78,133.53 0 top
C1  27.25,3.76 90 top
C2  27.25,8.05 270 top
C3  43.08,114.76 0 top
C4  43.1,116.84 0 top
C5  45.85,3.56 90 top
C6  37.87,99.39 270 top
C7  37.87,103.5 90 top
C8  45.85,8.13 270 top
CRYSTAL  42.42,100.84 270 top
D1  68.71,35.81 180 top
D2  59.69,71.12 90 top
D3  46.23,51.82 90 bottom
IC2  32.38,6.22 90 top
IC3  40.77,6.22 90 top
JMP  72.39,37.85 270 bottom
LED1  69.85,91.19 0 top
LED2  72.39,91.19 0 top
LED3  74.93,91.19 0 top
LED4  28.07,63.78 0 top
LED5  30.23,12.34 270 top
LED6  26.06,63.75 0 top
LED7  42.93,12.27 90 top
LED8  36.45,45.34 180 top
LED9  66.04,40.26 90 top
PEDALS  52.07,42.93 180 top
PI_EVEN  3.02,78.79 90 top
PI_ODD  5.56,78.79 90 top
POWER  97.28,80.01 270 top
R1  55.63,87.38 0 bottom
R2  69.85,95 270 top
R3  72.39,95 270 top
R4  74.93,95 270 top
R5  47.17,114.78 0 top
R6  38.86,56.39 90 bottom
R7  3.94,59.56 270 top
R8  7.37,59.56 270 top
R9  68.96,27.43 270 top
R10  74.04,27.43 90 top
R11  64.26,27.43 90 top
R12  38.61,45.59 270 top
R13  60.71,76.71 180 top
R14  60.71,79.76 0 top
R15  17.25,76.23 180 top
R16  17.25,74.19 180 top
R17  17.25,72.11 180 top
R18  17.2,70.1 180 top
R19  35.36,58.83 180 top
R20  37.26,56.54 180 top
R21  35.94,52.45 180 top
R22  33.53,48.13 180 top
R23  47.17,116.84 0 top
R24  9.58,109.09 90 top
R25  28.07,67.94 90 top
R26  34.29,12.34 0 top
R27  26.04,67.94 90 top
R28  38.61,12.27 180 top
R29  66.04,42.55 0 top
SOFTWARE_SHUTOFF  45.72,49.53 0 top
U$1  48.01,68.58 0 top
U$2  85.85,114.81 0 top
U$3  55.12,81.28 0 bottom
U$4  28.96,54.36 90 top
U$5  40.64,62.36 0 bottom
U$6  8.38,67.31 180 top
U$7  37.26,54.51 0 top
U$8  35.99,50.19 0 top
U$9  22.48,49.91 0 top
U$10  19.3,116.59 180 top
U$11  29.21,119.13 0 top
U$12  29.92,42.82 270 top
U$13  99.67,114.86 0 top
U$14  99.67,109.02 0 top
U$15  85.6,131.83 0 top
U$16  92.71,131.83 0 top
U$17  100.08,131.83 0 top
U$18  37.08,31.75 90 top
U$19  28.07,47.24 0 top
U$20  18.41,49.91 0 top
U$21  22.48,52.32 0 top
U$22  18.41,52.32 0 top
X1  40.74,84.51 90 top
X2  40.74,72.39 90 top
X3  17.27,106.17 270 bottom
X4  69.6,18.8 0 bottom
X5  69.09,122.94 180 bottom
X6  17.78,34.54 270 bottom

### Tracks (layer width: path | path; a pad name or v marks a point on that pad's centre or on a via)
+5V  (via drill 0.4, 0.45, 0.5, 0.55, 0.7)
  Top 0.406: X4.1 81.28,21.84 | v54.48,80.75 56.79,83.06 56.79,99.19 60.48,102.87 U$1.VIN | U$12.5 31.77,41.47 v33.02,42.72 | 82.8,50.8 84.23,50.8 85.32,51.89 v86.18,51.89 | U$18.15 U$18.16 36.07,25.65 v36.83,25.65 | v17.02,44.58 17.53,45.09 17.53,49.77 U$20.1 U$22.1 | v23.88,21.08 v28.19,25.4 | 82.8,26.8 81.27,28.33 74.17,28.33 R10.2 | 66.55,24.59 66.55,26.67 64.89,28.33 R11.2 | 66.55,24.59 X4.4 | R9.2 68.49,26.53 66.55,24.59 | 86.36,98.81 v89.28,95.89 | 86.36,98.81 BSPD1:CALIBRATE1.1 | v82.04,100.08 85.09,100.08 86.36,98.81 | v80.9,76.96 v75.95,76.96
  Top 0.61: v56.08,27.43 56.03,27.43 47.87,35.59 PEDALS.7 50.31,42.62 53.22,42.62 PEDALS.4 | v69.09,104.14 72.9,104.14 BSPD1:CALIBRATE3.1 75.44,100.46 v76.96,98.93 | X4.1 82.8,23.32 82.8,26.8 82.8,50.8 80.9,52.7 80.9,58.04 BSPD1:R5.P$2 | v80.39,64.36 75.59,64.36 v74.17,65.79 74.17,67.69 76.63,70.16 76.63,72.34 75.95,73.03 v75.95,76.96 | IC3.3 41.16,9.15 C8.1 45.85,10.4 | 45.85,10.4 LED7.A | v71.37,11.68 47.13,11.68 45.85,10.4
  Bottom 0.406: BSPD1:U$12.8 74.1,85.34 76.02,85.34 | BSPD1:U$10.8 73.91,65.85 v74.17,65.79 | BSPD1:U$4.8 74.17,75.5 | v54.48,80.75 U$3.3 | PEDALS.7 45.64,37.95 41.73,37.95 39.01,40.66 35.08,40.66 v33.02,42.72 | BSPD1:U$5.5 84.36,52.38 85.7,52.38 v86.18,51.89 86.96,51.11 86.96,50.59 BSPD1:U$6.5 | v17.02,44.58 17.4,44.2 17.4,22.1 19.56,19.94 22.73,19.94 v23.88,21.08 | v36.83,25.65 28.45,25.65 v28.19,25.4 | BSPD1:CALIBRATE2.1 97.28,100.97 92.2,95.89 v89.28,95.89 | v82.04,100.08 79.76,100.08 78.23,101.6 BSPD1:CALIBRATE3.1 | BSPD1:U$4.8 74.04,74.68 73.15,73.79 71.75,73.79 71.5,74.04 BSPD1:U$4.6 | v75.95,76.96 74.48,75.5 BSPD1:U$4.8 | BSPD1:R7.2 81.14,76.96 v80.9,76.96 81.27,76.96 BSPD1:R4.1
  Bottom 0.61: PEDALS.7 47.87,41.48 PEDALS.1 | X4.7 72.42,18.82 68.38,18.82 65.41,21.79 X4.4 61.72,21.79 v56.08,27.43 54.3,25.65 v36.83,25.65 | X4.7 75.44,15.95 X4.1 | U$1.VIN 65.79,104.14 v69.09,104.14 | v75.95,76.96 76.02,77.04 76.02,85.34 76.02,97.48 76.96,98.42 v76.96,98.93 | BSPD1:R5.P$2 82.8,61.95 v80.39,64.36 | v71.37,11.68 75.44,15.75 X4.7
+5V/1  (via drill 0.4)
  Top 0.406: 24.09,123.95 U$11.18 | U$11.18 U$11.17 | U$11.18 24.13,125.35 19.61,129.87 14.17,129.87 11.53,127.23 11.53,122.58 12.83,121.28 | v8.1,88.44 8.1,116.43 12.83,121.16 12.83,121.28 | U$10.3 18.67,117.86 18.16,117.35 16.76,117.35 12.83,121.28
  Top 0.61: IC2.3 32.07,9.08 C2.1 27.25,10.42 LED5.A
  Bottom 0.406: v8.1,88.44 8.1,75.51 5.66,73.08
  Bottom 0.61: PI_EVEN.1 3.02,75.72 5.66,73.08 5.66,56.9 7.34,55.22 16.1,55.22 25.55,45.77 25.55,14.38 31.17,8.76 IC2.3
+12V  (via drill 0.4, 0.45, 0.6, 0.65, 1)
  Top 0.406: 10.41,66.55 10.29,66.42 U$6.14 | 10.41,66.55 7.75,66.55 | U$4.12 28.32,54.99 28.32,57.53 | 10.41,66.55 12.83,66.55 U$6.16 12.83,59.59 15.53,56.88 19.98,56.88 23.29,60.2 v26.34,60.2 27.3,60.2 28.32,59.18 28.32,57.53 | 7.75,66.55 U$6.12 | U$6.10 5.21,66.55 7.75,66.55 | U$4.10 28.32,57.53 | 21.45,51.18 U$9.1 | 21.45,51.18 U$21.1 | v24.89,48.64 24.89,50.67 24.4,51.17 21.47,51.17 21.45,51.18 | BSPD1:U$2.4 v98.81,64.01
  Top 0.61: v87.12,43.43 93.85,50.16 v93.85,52.07 | POWER.7 102.62,78.39 v102.62,99.19 | C5.1 41.92,2.53 IC3.1 | C1.1 31.44,2.73 IC2.1 | BSPD1:U$3.4 76.58,97.66 75.56,97.66 v74.93,98.3
  Top 1.27: v53.85,130.43 58.75,130.43 X5.7 | v33.43,100.31 33.43,100.51 27.76,106.17 17.2,106.17 X3.1
  Bottom 0.406: 23.81,51.5 23.94,51.5 | v24.89,48.64 24.89,50.04 25.15,50.29 | v98.81,64.01 98.55,63.75 95.83,63.75
  Bottom 0.61: 70.23,105.66 46.35,105.66 | 70.23,105.66 97.54,105.66 102.62,100.58 v102.62,99.19 | X2.1 40.64,71.64 40.64,66.8 | 40.64,66.8 41.91,65.53 U$5.4 | 26.34,62.36 v26.34,60.2 | 26.34,62.36 21.74,57.76 21.74,53.7 23.94,51.5 25.15,50.29 26.82,48.62 26.82,17.25 34.92,9.14 34.92,3.68 | 26.34,62.36 30.79,66.8 40.64,66.8 | POWER.7 98.3,74.08 98.3,70.23 95.83,67.77 95.83,63.75 95.83,58.29 93.85,56.31 v93.85,52.07 | BSPD1:U$1.2 80.91,43.3 BSPD1:D2.C 86.98,43.3 v87.12,43.43 | IC3.1 34.92,3.68 | 34.92,3.68 IC2.1 | v74.93,98.3 73.79,99.44 70.1,99.44 68.83,100.71 68.83,102.23 70.23,103.63 70.23,105.66
  Bottom 1.27: 43.49,87.62 33.43,97.69 v33.43,100.31 | 43.49,87.62 X1.1 | 43.49,87.62 46.35,90.49 46.35,105.66 46.35,110.74 48.01,112.39 48.01,124.59 v53.85,130.43
  Bottom 1.778: X1.1 46.41,83.7 46.41,80.95 43.49,78.04 X2.1
BSPD1:N$1  (via drill 0.45)
  Top 0.406: BSPD1:U$3.COIL- 88.65,68.07 99.14,68.07 101.35,65.86 BSPD1:U$2.3 | v75.06,80.26 73.85,79.06 73.85,73.34 v75.56,71.63
  Bottom 0.406: BSPD1:U$3.COIL- 83.44,73.28 81.97,73.28 | 81.79,87.45 81.79,82.45 79.93,80.59 79.93,75.31 81.97,73.28 | BSPD1:D1.C 81.79,90.03 81.79,87.45 | 81.79,87.45 BSPD1:U$3.3 | v75.06,80.26 75.06,78.61 74.68,78.23 72.01,78.23 70.23,76.45 BSPD1:U$4.5 | v75.56,71.63 77.22,73.28 81.97,73.28
BSPD1:N$2  (via drill 0.4)
  Top 0.406: v84.43,58.93 v84.43,53.39
  Bottom 0.406: v84.43,53.39 83.48,53.39 BSPD1:U$5.4 | BSPD1:R3.2 84.56,59.05 v84.43,58.93
BSPD1:N$3
  Top 0.406: BSPD1:R6.2 96.48,62.06 BSPD1:U$2.1
BSPD1:N$4  (via drill 0.45)
  Top 0.406: BSPD1:R6.1 96.45,60.01 v98.42,58.04 | v98.42,53.65 100.33,51.74 BSPD1:BSPD_ENABLE.1
  Bottom 0.406: v98.42,58.04 v98.42,53.65
BSPD1:N$5  (via drill 0.45)
  Top 0.406: v73.03,58.55 74.55,57.02 76.45,57.02 77.72,58.29 77.72,60.71 80.39,63.37 87.12,63.37 90.81,67.06 v91.95,67.06 | v91.95,72.52 92.58,73.15 92.58,85.22 93.73,86.36 95.5,86.36 96.14,87 96.14,91.69 v92.84,95
  Bottom 0.406: BSPD1:CALIBRATE2.2 96.27,103.12 98.42,103.12 98.81,102.74 98.81,100.97 v92.84,95 | BSPD1:U$10.2 71.5,59.56 72.52,58.55 v73.03,58.55 | v91.95,67.06 v91.95,72.52
BSPD1:N$6  (via drill 0.45)
  Top 0.406: v77.6,70.36 77.6,75.06 78.49,75.95 81.28,75.95 82.68,77.34 v82.68,80.64
  Bottom 0.406: BSPD1:CALIBRATE1.2 83.82,101.09 84.58,100.33 84.58,98.42 83.44,97.28 83.44,88.01 82.68,87.25 v82.68,80.64 | BSPD1:U$10.6 70.23,67.18 70.74,67.69 74.93,67.69 v77.6,70.36
BSPD1:N$7
  Bottom 0.406: BSPD1:U$4.2 72.77,71.98 77.09,76.3 77.09,91.44 78.68,93.03 81.09,93.03 81.53,93.47 81.53,96.14 77.47,100.2 74.3,100.2 BSPD1:CALIBRATE3.2
BSPD1:N$8  (via drill 0.45)
  Top 0.406: v79.12,74.55 81.03,74.55 83.69,77.22 86.36,77.22 87.63,75.95 87.63,73.15 91.82,68.96 100.08,68.96 102.36,66.67 102.36,64.14 100.2,61.98 v100.08,61.98 | BSPD1:BSPD_ENABLE.2 98.55,44.96 96.39,47.12 v96.39,52.96
  Bottom 0.406: BSPD1:U$4.1 74.04,71.63 76.96,74.55 v79.12,74.55 | v96.39,52.96 96.39,57.66 100.08,61.34 v100.08,61.98
BSPD1:N$13
  Bottom 0.406: BSPD1:U$12.3 71.5,79.12 68.83,76.45 68.83,74.07 71.5,71.4 BSPD1:U$4.3 71.5,69.06 72.08,68.48 72.1,68.49 74.46,68.49 77.56,71.59 80.56,71.59 86.61,65.53 BSPD1:C1.1 90.07,65.28 91.29,64.06 91.29,60.81 BSPD1:R5.P$1 89.53,59.05 BSPD1:R3.1
BSPD1:N$14
  Top 0.406: BSPD1:R8.1 BSPD1:LED2.C
BSPD1:N$15
  Top 0.406: BSPD1:LED1.C BSPD1:R9.1
BSPD1:N$16  (via drill 0.45)
  Top 0.406: BSPD1:LED1.A 69.88,79.91 69.47,79.5 69.47,66.67 71.5,64.64 v71.5,64.01 71.5,61.4 73.37,59.53 74.77,59.53 v74.8,59.56 | v87.38,56.64 89.66,54.36 91.69,54.36 v92.2,53.85 93.6,55.24 98.68,55.24 103.12,59.69 103.12,77.6 103.5,77.98 103.5,98.42 103.76,98.68 103.76,99.82 102.62,100.97 102.62,104.14 103.76,105.28 103.76,113.54 100.08,117.22 95.17,117.22 BSPD1:U$11.P$1
  Bottom 0.406: BSPD1:U$5.2 82.68,48.51 83.31,47.88 84.33,47.88 84.71,48.26 86.49,48.26 86.77,47.98 BSPD1:U$6.2 86.74,47.11 86.74,46.35 87.25,45.85 88.14,45.85 92.84,50.55 92.84,53.21 v92.2,53.85 | v87.38,56.64 78.74,56.64 75.82,59.56 v74.8,59.56 | BSPD1:U$10.7 v71.5,64.01
BSPD1:N$17  (via drill 0.45)
  Top 0.406: BSPD1:LED2.A 70.48,79.16 70.48,66.93 73.91,63.5 73.91,60.52 v73.84,60.45 | v86.23,57.53 86.23,55.88 v88.65,53.47 91.06,53.47 91.95,52.58 92.33,52.58 94.23,54.48 99.19,54.48 103.89,59.18 103.89,77.22 104.39,77.72 104.39,98.17 104.52,98.3 104.52,100.58 v103.63,101.47
  Bottom 0.406: BSPD1:U$5.1 83.67,48.9 87,48.9 87.72,48.17 BSPD1:U$6.1 88.29,47.14 92.08,50.93 92.08,52.45 91.06,53.47 v88.65,53.47 | 72.77,60.33 BSPD1:U$10.1 72.97,60.45 v73.84,60.45 76.58,60.45 79.5,57.53 v86.23,57.53 | v103.63,101.47 98.42,106.68 94.74,106.68 92.81,108.61 BSPD1:U$13.P$1
BSPD1:SHUTDOWN_C
  Bottom 1.778: BSPD1:U$3.6 88.21,89.74 91.95,93.22 100.58,93.22 103.63,90.42 103.63,55.04 89.53,40.95 BSPD1:U$1.S
BUT  (via drill 0.4)
  Top 0.406: v4.29,128.96 v4.29,100.38
  Bottom 0.406: PI_ODD.2 4.29,82.6 v4.29,100.38 | BUTTON.3 33.53,129.87 30.58,126.92 24.74,126.92 20.42,131.24 12.17,131.24 9.88,128.96 v4.29,128.96
CAN-H  (via drill 0.45)
  Top 0.406: U$10.7 19.94,112.78 20.7,112.01 21.84,112.01 22.99,113.16 v39.62,113.16 | R5.2 48.13,114.72 48.13,113.41 47.5,112.78 v42.04,112.78
  Bottom 0.406: v42.04,112.78 41.66,113.16 v39.62,113.16
CAN-L  (via drill 0.4, 0.45)
  Top 0.406: U$10.6 18.67,112.57 18.16,112.06 11.4,112.06 v10.52,112.95 | R23.2 48.19,128.21 v43.18,133.22
  Bottom 0.406: v10.52,112.95 9.63,113.84 9.63,125.93 14.22,130.53 19.91,130.53 24.28,126.16 33.05,126.16 36.45,129.56 36.45,131.83 37.85,133.22 v43.18,133.22
CANH  (via drill 0.4, 0.45)
  Top 0.406: X2.4 35.28,73 35.28,77.5 | 35.28,77.5 35.28,79.7 X1.4 39.92,82.41 41.53,84.02 45.33,84.02 48.01,81.34 50.72,81.34 53.98,84.59 v53.98,89.15 | v33.63,79.12 35.26,77.5 35.28,77.5 | v52.7,106.93 52.45,106.68 v52.45,100.84 | POWER.10 100.03,100.16 100.71,100.84 100.71,105.41 v101.73,106.43
  Bottom 0.406: 33.63,79.15 v33.63,79.12 20.27,92.48 X3.4 | v52.7,106.93 54.74,108.97 54.74,121.54 55.75,122.56 77.39,122.56 X5.10 89.74,116.97 93.6,116.97 95.12,115.44 95.12,113.28 96.9,111.51 100.2,111.51 101.73,109.98 v101.73,106.43 | v52.45,100.84 52.45,92.2 53.98,90.68 v53.98,89.15 56.01,89.15 56.64,88.52 R1.1 56.65,86.24 55.75,85.34 U$3.7
CANL  (via drill 0.4, 0.45)
  Top 0.406: X1.3 39.67,88.29 44.86,88.29 46.58,86.57 52.86,86.57 v52.93,86.64 | v51.44,107.06 v51.44,101.73 | POWER.9 101.73,85.91 101.73,93.6 101.09,94.23 101.09,99.57 101.73,100.2 101.73,104.78 v102.62,105.66 | v26.29,107.95 25.15,109.09 X3.3
  Bottom 0.406: X2.3 35.02,77.46 35.02,83.65 X1.3 26.29,98.32 v26.29,107.95 | U$3.6 54.48,87.11 R1.2 53.67,87.38 v52.93,86.64 52.7,86.87 52.7,90.55 51.44,91.82 v51.44,101.73 | v51.44,107.06 53.98,109.6 53.98,122.05 55.35,123.42 72.42,123.42 X5.9 77.52,128.52 82.61,128.52 83.76,127.38 83.76,124.4 90.3,117.86 93.85,117.86 96.27,115.44 96.27,114.05 97.79,112.52 100.33,112.52 102.62,110.24 v102.62,105.66
CS  (via drill 0.4)
  Top 0.406: U$11.16 26.64,123.94 v26.64,125.27 | v10.64,121.97 9.37,120.7 v8.36,120.7
  Bottom 0.406: v26.64,125.27 24.23,125.27 19.79,129.72 14.33,129.72 10.64,126.03 v10.64,121.97 | PI_EVEN.12 4.29,108 4.29,120.32 4.67,120.7 v8.36,120.7
DASH_CTRL1
  Top 0.406: U$1.D2 48.87,95.25 45.31,91.69 32.82,91.69 18.15,77.02 R15.1
DASH_CTRL2
  Top 0.406: R16.1 18.64,74.19 19.66,75.21 19.66,76.76 33.68,90.78 46.13,90.78 U$1.D5
DASH_CTRL3  (via drill 0.45)
  Top 0.406: v46.74,88.14 44.96,89.92 34.59,89.92 20.68,76 20.68,74.22 18.57,72.11 R17.1
  Bottom 0.406: v46.74,88.14 46.74,87.63 U$1.D6
DASH_CTRL4
  Top 0.406: R18.1 18.34,70.1 21.69,73.46 21.69,75.23 31.17,84.71 45.92,84.71 48.08,82.55 U$1.D7(RX3)
DASH_CTRL5
  Top 0.406: R19.1 37.49,58.83 46.86,68.2 50.42,68.2 51.37,69.15 51.37,77.92 U$1.D8(TX3)
DASH_CTRL6  (via drill 0.4)
  Top 0.406: v44.48,67.82 46.61,69.95 46.61,75.16 48.92,77.47 U$1.D9(RX2) | U$7.2 R20.1 38.16,57.8 v44.93,64.57
  Bottom 0.406: v44.93,64.57 44.93,67.36 v44.48,67.82
DASH_CTRL7  (via drill 0.4, 0.6)
  Top 0.406: v49.53,49.53 39.62,49.53 38.48,50.67 38.48,51.56 37.59,52.45 R21.1 36.97,50.24 U$8.2 | v55.88,49.53 58.65,52.3 58.65,61.24 v57.4,62.48
  Bottom 0.406: v49.53,49.53 v55.88,49.53 | U$1.D10(TX2) 50.29,73.91 54.36,73.91 56.64,71.63 56.64,63.25 v57.4,62.48
DASH_CTRL8  (via drill 0.4, 0.6)
  Top 0.406: v57.15,60.71 57.15,53.09 v55.37,51.31 | U$12.2 29.92,45.29 30.86,46.23 | U$19.2 29.84,47.24 30.86,46.23 | v52.32,50.55 50.29,48.51 38.35,48.51 37.85,48.01 34.55,48.01 R22.1 34.55,47.25 33.53,46.23 30.86,46.23
  Bottom 0.406: v57.15,60.71 55.63,62.23 55.63,69.34 52.58,72.39 U$1.D11 | v55.37,51.31 53.09,51.31 v52.32,50.55
DASH_CTRL9  (via drill 0.4, 0.5)
  Top 0.406: v66.55,44.32 66.55,60.71 65.53,61.72 65.53,67.56 66.55,68.58 66.55,81.28 65.28,82.55 U$1.A4 | v28.19,30.99 23.06,30.99 X6.9
  Bottom 0.406: v66.55,44.32 66.55,37.36 61.19,32 41.91,32 40.39,30.48 28.7,30.48 v28.19,30.99
DASH_CTRL10  (via drill 0.4, 0.6)
  Top 0.406: v28.19,29.46 27.38,29.46 X6.10 | v68.07,44.32 68.07,60.35 66.55,61.87 66.55,67.31 67.31,68.07 67.31,83.57 65.79,85.09 U$1.A5
  Bottom 0.406: v28.19,29.46 60.43,29.46 68.07,37.11 v68.07,44.32
DASH_IO1  (via drill 0.4)
  Top 0.406: R7.2 v3.94,57.1
  Bottom 0.406: v3.94,57.1 3.94,57.07 X6.1
DASH_IO2  (via drill 0.5)
  Top 0.406: v6.22,49.15 6.22,56.26 7.37,57.4 R8.2
  Bottom 0.406: v6.22,49.15 6.22,48.95 X6.2
DASH_IO3  (via drill 0.5)
  Top 0.406: U$6.13 9.12,64.54 9.12,57.4 7.37,55.65 v7.37,38.61
  Bottom 0.406: v7.37,38.61 11.43,34.54 X6.3
DASH_IO4  (via drill 0.5)
  Top 0.406: U$6.15 11.43,64.52 11.43,58.29 9.28,56.15 v9.28,31.36
  Bottom 0.406: v9.28,31.36 11.94,28.7 X6.4
DASH_IO5
  Top 0.406: X6.5 11.11,26.53 11.11,54.42 12.7,56.01 21.34,56.01 24.13,58.8 U$4.9
DASH_IO6  (via drill 0.4, 0.45)
  Top 0.406: U$4.11 25.27,56.26 v24.21,55.19 13.03,55.19 12.06,54.23 12.06,44.83 13.46,43.43 17.98,43.43 X6.6 | U$7.1 35.18,54.51 v34.76,54.09
  Bottom 0.406: v34.76,54.09 25.31,54.09 v24.21,55.19
DASH_IO7  (via drill 0.45, 0.5)
  Top 0.406: v13.21,53.85 13.72,54.36 23.24,54.36 v23.62,53.98 23.88,53.72 U$4.13 | U$8.1 34.52,50.19 v33.53,51.18
  Bottom 0.406: X6.7 18.2,42.96 18.2,47.33 15.88,49.66 14.48,49.66 14.05,50.09 14.04,50.09 12.88,51.25 12.88,53.52 v13.21,53.85 | v33.53,51.18 33.38,51.18 31.47,49.28 28.32,49.28 v23.62,53.98
DASH_IO8
  Top 0.406: U$12.4 27.71,41.47 27.18,40.95 | 27.18,40.95 X6.8 | 26.42,51.18 U$4.15 27.81,51.18 28.32,50.67 28.32,49.66 27.18,48.51 27.18,47.23 | 27.18,47.23 U$19.1 | 27.18,40.95 27.18,47.23
GND  (via drill 0.4, 0.45, 0.5, 0.6, 0.65, 0.7, 0.75, 0.85, 1)
  Top 0.406: R14.1 59.18,80.38 59.18,81.69 | 9.14,69.98 U$6.4 9.02,67.85 | U$6.2 11.56,67.85 | 14.28,103.38 X3.2 9.58,107.95 R24.1 | 11.56,67.85 9.02,67.85 | 9.02,67.85 6.48,67.85 | 6.48,67.85 U$6.6 | 6.48,67.85 3.94,67.85 U$6.8 | C6.1 C7.1 | 27.62,68.84 R25.2 R27.2 24.36,68.97 23.24,67.85 18.82,67.85 | 19.94,119.89 U$10.2 19.94,117.6 20.45,117.09 21.59,117.09 22.23,117.73 v22.99,117.73 | 42.18,116.81 C4.1 | 40.89,113.47 40.89,111.89 | 41.95,114.64 40.89,113.47 | 41.95,114.64 C3.1 | U$11.9 40.03,114.34 40.89,113.47 | U$12.3 29.01,44.14 29.01,43.16 29.95,42.22 29.95,38.68 30.56,38.08 | BSPD1:R8.2 BSPD1:R9.2 68.89,86.88 v68.28,86.26 | 18.82,67.85 11.56,67.85 | BUTTON.1 36.3,133.02 36.3,123.11 | v25.4,117.78 30.96,117.78 36.3,123.11 | U$18.14 31.7,29.84 30.56,30.99 | v55.75,76.2 55.5,76.2 54.48,75.18 | U$4.2 29.59,51.18 29.59,53.72 | 29.59,53.72 29.59,56.26 | 29.59,58.8 29.59,56.26 | 29.59,58.8 U$4.8 | U$4.6 29.59,56.26 | U$4.4 29.59,53.72 | 29.59,58.8 29.59,59.96 v29.08,60.47 28.29,61.27 25.4,61.27 18.82,67.85 | C4.1 v39.5,116.84 36.3,120.04 36.3,123.11 | U$18.9 34.42,37.85 32.37,39.89 | LED8.C 35.41,43.25 v35.41,42.8 | 41.95,114.64 42.08,114.77 C4.1 | PEDALS.5 60.88,45.68 62.61,43.94 62.61,42.64 LED9.C | v81.66,123.06 71.96,123.06 X5.8
  Top 0.61: R2.1 R3.1 R4.1 75.53,95.9 76.83,94.59 76.83,88.77 78.49,87.12 80.54,87.12 85.06,82.6 88.7,82.6 v89.28,83.19 | X4.2 75.44,21.64 X4.8 | X4.5 57.91,27.94 52.07,33.78 PEDALS.8 | v59.18,83.82 59.18,81.69 54.48,76.99 54.48,75.18 54.48,66.67 52.22,64.41 SOFTWARE_SHUTOFF.1 49,64.41 43.92,59.33 43.92,50.9 v43.88,50.86 | v71.4,57.38 77.06,51.71 BSPD1:U$1.1 77.34,55.12 79.5,57.28 79.5,59.54 80.02,60.06 | v61.47,100.46 61.47,97.92 62.87,96.52 66.17,96.52 66.67,96.02 R2.1 | R2.1 69.85,101.09 BSPD1:CALIBRATE3.3 | v35.41,42.8 32.37,39.89 30.56,38.08 30.56,30.99 30.56,18.11 35.31,13.35 R26.2 35.39,12.27 | 80.02,60.06 81.69,61.72 84.05,61.72 89.64,56.13 98.15,56.13 101.35,59.33 BSPD1:U$2.2 | 20.22,97.31 8.05,85.14 5.04,85.14 3.77,83.87 PI_EVEN.3 | C7.1 37.02,102.61 34.29,105.33 34.29,110.24 35.94,111.89 40.89,111.89 42.16,110.62 45.34,110.62 49.28,106.68 U$1.GND | v80.77,59.44 80.15,60.06 80.02,60.06 | R28.2 35.39,12.27 | C5.2 C8.2 44.19,7.1 43.31,6.22 IC3.2 IC2.2 | C1.2 C2.2 27.3,6.99 29.84,6.99 30.61,6.22 IC2.2 | 35.39,12.27 35.39,9.23 IC2.2
  Top 1.27: X3.2 20.22,97.31 v29.21,97.31 | v50.42,131.06 51.82,132.46 62.56,132.46 X5.8
  Top 1.778: X1.2 40.46,79.39 40.46,73.22 43.39,70.29 X2.2
  Bottom 0.406: 59.18,81.03 v59.18,83.82 59.12,83.88 U$3.8 | 61.92,83.88 65.66,83.88 | 66.8,73.66 67.31,74.17 | BSPD1:U$4.4 67.98,70.3 67.31,70.97 | v68.28,86.26 66.17,84.15 66.17,83.88 | BSPD1:D2.A 85.85,47.1 BSPD1:U$6.3 | BSPD1:U$5.3 81.53,48.94 80.82,48.23 | U$3.2 v55.75,76.2 | v25.4,117.78 23.04,117.78 v22.99,117.73 | BSPD1:D1.A 82.55,92.59 82.55,97.66 83.57,98.68 83.57,99.82 81.79,101.6 BSPD1:CALIBRATE1.3 | D3.A 43.93,50.92 v43.88,50.86 | 37.72,116.2 38.35,116.84 v39.5,116.84 | U$2.P$1 85.85,118.87 v81.66,123.06
  Bottom 0.61: 52.07,40.64 47.87,44.84 PEDALS.2 43.88,49.67 v43.88,50.86 | PEDALS.8 52.07,40.64 | 52.07,40.64 54.36,42.93 57.4,42.93 60.15,45.68 PEDALS.5 | v43.88,50.86 39.25,55.49 R6.1 34.19,55.36 v29.08,60.47 | X4.8 66.6,18.8 60.91,18.8 X4.5 | X2.2 49.37,64.41 SOFTWARE_SHUTOFF.1 | v59.18,83.82 59.24,83.88 65.66,83.88 66.17,83.88 67.31,82.74 67.31,80.2 | 67.31,80.2 BSPD1:U$12.4 | 67.31,80.2 67.31,74.17 67.31,70.97 67.31,62.3 BSPD1:U$10.4 68.96,59.05 70.64,57.38 v71.4,57.38 | BSPD1:U$3.COIL+ 79.63,69.72 82.36,66.99 | BSPD1:C1.2 82.36,66.99 | BSPD1:CALIBRATE3.3 73.15,104.39 78.49,104.39 | 78.49,104.39 BSPD1:CALIBRATE1.3 | BSPD1:U$1.1 80.82,48.23 83.96,45.1 BSPD1:D2.A | v43.88,50.86 43.34,50.86 v35.41,42.8 | v89.28,83.19 89.28,82.04 93.34,77.98 97.16,77.98 99.19,80.01 POWER.8 | BSPD1:CALIBRATE2.3 92.2,103.38 91.19,104.39 78.49,104.39 | v80.77,59.44 80.77,60.96 78.99,62.74 78.99,64.77 79.88,65.66 81.03,65.66 82.36,66.99 | U$1.GND 59.05,102.87 v61.47,100.46
  Bottom 1.27: X1.2 40.64,85.27 40.64,87.76 31.09,97.31 | v29.21,97.31 31.09,97.31 | v50.42,131.06 48.26,128.91 38.99,128.91 34.92,124.84 34.92,120.14 37.72,117.35 37.72,116.2 37.72,108.08 31.09,101.45 31.09,97.31
INT  (via drill 0.4)
  Top 0.406: U$11.12 v31.75,120.4
  Bottom 0.406: PI_EVEN.11 4.29,105.46 6.45,105.46 7.72,106.73 7.72,108.1 11.68,112.06 11.68,119.99 12.09,120.4 v31.75,120.4
LED1  (via drill 0.4)
  Top 0.406: LED4.A 29.69,64.36 v29.69,67.74
  Bottom 0.406: v29.69,67.74 23.42,67.74 11.35,79.81 11.35,90.78 PI_ODD.8
LED2  (via drill 0.45)
  Top 0.406: LED6.A 23.88,64.89 v23.88,64.9
  Bottom 0.406: PI_ODD.7 9.92,89.67 9.92,78.85 v23.88,64.9
MCP3208_CS  (via drill 0.4, 0.5)
  Top 0.406: U$1.A0 64.01,72.39 61.98,70.36 61.98,68.58 58.67,65.28 58.67,62.99 59.69,61.98 62.23,61.98 64.64,59.56 v64.64,46.48 | U$18.10 33.78,34.92 v32.26,36.45
  Bottom 0.406: v64.64,46.48 64.64,38.1 60.45,33.91 42.04,33.91 39.5,36.45 v32.26,36.45
MCP3208_DIN  (via drill 0.4, 0.5)
  Top 0.406: U$18.11 33.15,33.66 v32.51,34.29 | U$1.D1(TX1) 54.99,92.08 54.99,84.2 52.7,81.92 52.7,68.58 51.44,67.31 47.88,67.31 46.1,65.53 45.97,65.41 45.97,63.88 42.04,59.94 42.04,53.09 v41.02,52.07
  Bottom 0.406: v41.02,52.07 41.02,50.42 40.32,49.72 38.29,49.72 30.35,41.78 30.35,36.45 v32.51,34.29
MCP3208_DOUT  (via drill 0.4, 0.5)
  Top 0.406: v31.88,32.77 32.26,32.38 U$18.12 | U$1.D0(RX1) 55.75,93.85 55.75,83.69 53.47,81.41 53.47,67.82 52.07,66.42 48.51,66.42 46.86,64.77 46.86,63.5 42.93,59.56 42.93,52.58 41.27,50.93 v39.62,50.93
  Bottom 0.406: v39.62,50.93 38.23,50.93 29.34,42.04 29.34,35.31 v31.88,32.77
MCP3208_SCK  (via drill 0.4, 0.5)
  Top 0.406: U$1.D13 64.77,69.6 64.77,61.21 65.53,60.45 v65.53,45.34 | U$18.13 32,31.11 v31.62,31.5
  Bottom 0.406: v65.53,45.34 65.53,37.59 60.96,33.02 41.4,33.02 40.64,32.26 37.08,32.26 36.32,31.5 v31.62,31.5
MISO  (via drill 0.4)
  Top 0.406: v27.94,118.87 U$11.15
  Bottom 0.406: PI_ODD.11 7.59,104.19 9.96,106.55 21.72,106.55 27.94,112.78 v27.94,118.87
MOSI  (via drill 0.4)
  Top 0.406: U$11.14 v29.21,118.87
  Bottom 0.406: PI_ODD.10 7.09,101.65 11.14,105.7 22.26,105.7 29.21,112.65 v29.21,118.87
N$1
  Top 0.406: R7.1 U$6.9
N$2
  Bottom 0.406: U$3.4 53.21,78.87 51.18,80.9 51.18,88.65 49.66,90.17 U$1.D4(CANRX)
N$3
  Top 0.406: R8.1 6.48,61.35 U$6.11
N$4
  Top 0.406: U$20.2 19.19,49.58 20.07,48.7 22.3,48.7 | U$4.16 26.29,48.64 25.02,47.37 23.63,47.37 22.3,48.7 | 22.3,48.7 U$9.2
N$5
  Bottom 0.406: U$3.1 57.02,82.02 51.94,82.02 51.94,90.17 49.4,92.71 U$1.D3(CANTX)
N$6
  Top 0.406: U$22.2 19.19,52.84 19.94,53.59 22.23,53.59 U$21.2 23.63,52.45 U$4.14
N$7  (via drill 0.5)
  Top 0.406: v42.42,30.48 41.78,29.84 U$18.3 | 67.69,35.81 D1.C | 67.69,35.81 64.9,35.81 v59.94,30.86 | R9.1 68.96,34.54 67.69,35.81
  Bottom 0.406: v59.94,30.86 59.56,30.48 v42.42,30.48
N$8
  Top 0.406: R12.2 36.79,46.39 LED8.A
N$9
  Top 0.406: R29.2 67.06,40.28 LED9.A
N$12  (via drill 0.45)
  Top 0.406: R12.1 39.49,47.5 v49.4,47.5
  Bottom 0.406: D3.C 46.23,54.36 | v49.4,47.5 48.13,48.77 48.13,50.77 SOFTWARE_SHUTOFF.2
  Bottom 0.61: U$5.3 40.64,64.09 40.64,56.64 42.93,54.36 46.23,54.36 47.85,54.36 SOFTWARE_SHUTOFF.2
N$13
  Top 0.305: D2.C 59.69,77.35 R13.2
N$14
  Top 0.61: R2.2 LED1.C
N$15
  Top 0.61: LED2.C R3.2
N$16
  Top 0.61: LED3.C R4.2
N$19
  Top 0.406: U$6.7 5.21,71.2 10.24,76.22 R15.2
N$22
  Bottom 0.61: U$5.2 38.86,58.85 R6.2
N$24
  Top 0.406: U$6.5 7.75,70.84 11.1,74.19 R16.2
N$27
  Top 0.406: U$4.3 R21.2
N$28
  Top 0.406: U$6.3 10.29,71.09 11.3,72.11 R17.2
N$29
  Top 0.406: U$6.1 R18.2
N$31
  Top 0.406: U$4.7 33.16,57.53 R19.2
N$32
  Top 0.406: U$4.5 33.5,54.99 35.05,56.54 R20.2
N$35
  Top 0.406: U$4.1 31.75,49.01 R22.2
N$37
  Top 0.406: U$11.1 24.13,119.19 U$10.1
N$39  (via drill 0.4)
  Top 0.406: v25.4,116.33 U$11.2 | v16.26,119.38 16.45,119.19 U$10.4
  Bottom 0.406: v25.4,116.33 19.3,116.33 v16.26,119.38
N$40  (via drill 0.4)
  Top 0.406: v33.02,116.08 U$11.8 | v33.02,111 33.02,104.1 35.31,101.82 35.31,100.08 37.02,98.36 C6.2 40.06,98.36 CRYSTAL.2
  Bottom 0.406: v33.02,111 v33.02,116.08
N$41
  Top 0.406: U$10.8 21.21,115.57 20.57,116.2 16.64,116.2 14.99,117.86 11.56,117.86 9.58,115.88 R24.2
N$42  (via drill 0.45)
  Top 0.406: 39.13,105.66 C7.2 | CRYSTAL.1 39.13,105.66 | v33.91,118.62 31.75,116.46 U$11.7 | v35.56,109.22 35.57,109.22 39.13,105.66
  Bottom 0.406: v33.91,118.62 34.8,117.73 34.8,109.98 v35.56,109.22
N$43
  Top 0.406: R5.1 45.73,114.76 C3.2
N$50
  Top 0.406: C4.2 R23.1
N$52
  Top 0.406: LED4.C R25.1
N$53
  Top 0.406: LED5.C R26.1
N$54
  Top 0.406: 25.73,64.85 LED6.C 26.04,64.83 R27.1
N$61
  Top 0.61: LED7.C R28.1
RAW_ACCEL1  (via drill 0.5)
  Top 0.406: U$18.1 41.78,27.3 v41.91,27.18 | R11.1 62.24,26.41 v60.71,27.94
  Top 0.61: 63.7,15.8 X4.9 60.71,18.85 v60.71,27.94 56.27,32.38 PEDALS.9
  Bottom 0.406: v41.91,27.18 53.98,27.18 55.5,28.7 59.94,28.7 v60.71,27.94
RAW_ACCEL2
  Top 0.406: U$18.2 43.18,28.57 46.56,25.2 | PEDALS.6 46.56,37.29 46.56,25.2 | 46.56,25.2 46.56,22.43 56.01,12.98 78.46,12.98 X4.6 78.23,18.85 78.23,23.37 75.19,26.41 R10.1
RAW_BRAKE  (via drill 0.6)
  Top 0.406: 70.87,23.11 70.87,23.37 | 70.75,26.53 70.87,26.42 | D1.A 70.87,35.81
  Top 0.61: v70.87,45.72 70.87,35.81 70.87,26.42 70.87,23.37 70.87,23.06 X4.3
  Bottom 0.406: 70.87,41.66 v70.87,45.72 72.39,44.2 JMP.A
  Bottom 0.61: PEDALS.3 54.27,47.88 68.71,47.88 v70.87,45.72
READ_CHARGE  (via drill 0.4, 0.45)
  Top 0.406: v73.41,88.9 73.41,89.12 | v73.41,88.9 72.39,89.92 LED2.A | v54.61,124.16 54.61,117.6 66.55,105.66 66.55,99.82 65.79,99.06 62.74,99.06 v62.48,98.81 | U$18.6 38.48,33.66 37.85,34.29 37.85,40.77 v39.12,42.04 | v73.41,88.9 74.53,87.78 74.53,83.55 v73.79,82.8 73.79,80.39 72.9,79.5 72.9,68.96 72.14,68.2 72.14,66.29 74.68,63.75 74.68,61.59 75.82,60.45 v75.82,58.17 | v60.07,56.77 59.44,56.13 59.44,51.18 56.39,48.13 55.63,48.13 54.1,46.61 54.1,44.7 53.09,43.69 49.78,43.69 48.13,42.04 v45.09,42.04
  Bottom 0.406: BSPD1:U$12.1 BSPD1:U$12.2 72.77,81.79 v73.79,82.8 | v73.41,88.9 63.25,88.9 62.48,89.66 v62.48,98.81 | v54.61,124.16 54.48,124.28 54.48,126.87 57.15,129.54 72.64,129.54 77.22,134.11 90.42,134.11 U$16.P$1 | v60.07,56.77 60.31,56.53 72.15,56.53 72.16,56.52 74.8,56.52 75.82,57.53 v75.82,58.17 | v45.09,42.04 v39.12,42.04
READ_FAULT  (via drill 0.4, 0.45, 0.5)
  Top 0.406: v74.14,106.81 74.14,106.7 69.88,106.7 68.2,105.03 68.2,99.57 v68.45,99.31 | 78.91,81.62 76.43,84.1 76.43,87.4 v74.93,88.9 LED3.A | X5.5 80.82,119.94 85.6,124.71 U$15.P$1 | 89.5,81.62 91.31,83.44 91.31,85.19 POWER.5 | 78.91,81.62 89.5,81.62 | 89.5,81.62 89.5,72.94 v90.87,71.56 | v92.2,60.45 95.25,57.4 v97.41,57.4 | v42.8,36.32 41.4,34.92 U$18.7 | v63.37,38.48 68.33,38.48 v68.96,39.12 | 78.91,81.62 74.8,77.52 v74.8,77.34
  Bottom 0.406: v74.14,106.81 80.77,113.44 X5.5 | v92.2,60.45 92.2,64.26 90.87,65.6 v90.87,71.56 | v97.41,57.4 97.41,52.45 82.8,37.85 70.23,37.85 v68.96,39.12 | v42.8,36.32 61.21,36.32 v63.37,38.48 | BSPD1:U$4.7 72.77,76.83 73.28,77.34 v74.8,77.34 | v74.93,88.9 74.93,96.65 73.15,98.42 69.34,98.42 v68.45,99.31
READ_SWITCH  (via drill 0.4, 0.45)
  Top 0.406: v97.1,66.8 95.08,64.78 90,64.78 87.81,62.59 80.87,62.59 78.5,60.21 78.5,57.57 76.94,56.01 74.17,56.01 70.55,59.63 | LED1.A v67.56,90.14 67.07,89.64 67.07,85.86 68.53,84.4 68.53,68 67.44,66.9 67.44,62.74 70.55,59.63 | v67.31,98.3 67.31,111.51 60.2,118.62 60.2,123.14 X5.6 | v58.29,34.8 62.61,34.8 64.9,37.08 68.71,37.08 69.85,38.23 69.85,50.04 v73.28,53.47 70.55,56.2 70.55,59.63 | v43.18,35.18 40.39,32.38 U$18.5
  Bottom 0.406: v97.1,66.8 100.03,69.73 POWER.6 | U$17.P$1 96.01,131.83 93.73,129.54 74.3,129.54 73.28,128.52 59.99,128.52 X5.6 | BSPD1:U$6.4 85.36,50.29 81.03,50.29 80.26,51.05 80.26,52.2 78.99,53.47 v73.28,53.47 | v58.29,34.8 43.56,34.8 v43.18,35.18 | v67.56,90.14 66.29,91.41 66.29,97.28 v67.31,98.3
READ_UPSTREAM_SHUTDOWN
  Top 0.406: 61.86,80.01 R14.2 61.73,78.23 | U$18.4 41.02,31.11 44.58,34.67 44.58,36.32 41.66,39.24 41.66,41.66 43.24,43.24 48.2,43.24 49.91,44.96 49.91,46.48 54.1,50.67 54.1,51.56 56.13,53.59 56.13,71.12 58.17,73.15 58.17,77.41 58.99,78.23 61.73,78.23 | 61.73,78.23 R13.1
SCK
  Top 0.406: U$11.13 30.48,124.77 29.08,126.16 25.5,126.16 21.06,130.61 13.18,130.61 7.09,124.51 7.09,108.38 5.56,106.86 PI_ODD.12
SHUTDOWN_A  (via drill 0.4, 0.9)
  Top 0.406: D2.A 58.95,69.48 v58.95,68.22
  Top 1.778: POWER.1 97.59,74.67 97.59,92.81 89.15,101.24 89.15,102.21 v78.11,113.26
  Bottom 0.406: v58.95,68.22 58.95,55.11 59.92,55.11
  Bottom 1.778: POWER.1 93.88,70.96 93.88,58.8 90.17,55.09 88.9,55.09 76.45,55.1 61.8,55.11 59.92,55.11 53.59,55.12 50.29,58.42 SOFTWARE_SHUTOFF.P | X5.1 64.08,113.26 v78.11,113.26
SHUTDOWN_B
  Top 0.406: SOFTWARE_SHUTOFF.S 61.98,48.26 63.5,46.74 63.5,44.06 R29.1
  Bottom 1.778: SOFTWARE_SHUTOFF.S 68.53,52.43 BSPD1:U$1.P
SHUTDOWN_D
  Top 1.778: X5.2 63.96,119.94 78.49,105.41 78.49,100.08 83.57,95 83.57,88.16 BSPD1:U$3.7
  Bottom 1.778: POWER.2 92.85,75.81 87,81.66 BSPD1:U$3.7
SHUTDOWN_RELAY_CTRL
  Bottom 0.61: U$1.D12 49.78,69.85 53.09,66.55 53.09,62.23 44.78,62.23 U$5.1
SIGNAL_BRAKE  (via drill 0.4, 0.45, 0.5)
  Top 0.406: X5.4 76.38,119.94 84.47,111.85 | 84.47,111.85 90.55,105.77 v90.55,103.25 | 84.47,111.85 96.66,111.85 U$13.P$1 | v87.63,100.35 87.63,99.44 90.47,96.6 v90.47,85.8 | v75.95,65.91 81.41,65.91 83.19,67.69 v86.74,67.69
  Bottom 0.406: POWER.4 92.07,84.21 v90.47,85.8 89.41,86.87 85.6,86.87 84.84,86.11 84.84,80.14 87.38,77.6 87.38,73.66 | 87.38,73.66 86.62,73.66 BSPD1:R4.2 | 88.77,73.66 87.38,73.66 | 88.77,73.66 95.76,73.66 97.54,75.44 97.54,76.58 98.81,77.85 100.97,77.85 101.85,76.96 101.85,55.75 83.06,36.96 JMP.C | v87.63,100.35 90.53,103.25 v90.55,103.25 | BSPD1:U$10.5 68.96,64.14 69.91,63.18 71.15,63.18 71.16,63.17 73.21,63.17 v75.95,65.91 | v86.74,67.69 88.14,67.69 88.77,68.33 88.77,73.66
SIGNAL_CURRENT  (via drill 0.4, 0.45, 0.5)
  Top 0.406: X5.3 69.09,119.13 79.88,108.33 79.88,100.84 83.82,96.9 v84.58,96.9 | v94.08,99.62 98.15,99.62 99.67,101.14 U$14.P$1 | v80.52,66.8 80.9,66.8 83.19,69.09 83.19,71.63 86.36,74.8 v86.36,75.56
  Bottom 0.406: 84.58,87.88 v84.58,96.9 91.36,96.9 v94.08,99.62 | 84.58,87.88 89.41,87.88 91.95,90.42 96.01,90.42 96.52,89.92 96.52,82 POWER.3 | 84.58,87.88 83.82,87.12 83.82,78.62 BSPD1:R7.1 85.34,78.11 86.36,77.09 v86.36,75.56 | BSPD1:U$10.3 70.23,61.98 70.61,62.36 74.42,62.36 78.86,66.8 v80.52,66.8

### Text on the board
tDocu: Fault | Charge | Switch | HyTech 2018 Front ECU rev5 | GND | Fault Brake | Input Brake | Fault Current | Input Current | Time | Brake | Current | SW | CH | FAULT | BR | CUR